# EAGLE design iot1 (EAGLE 9.6.2)

## Sheet 1 of 6
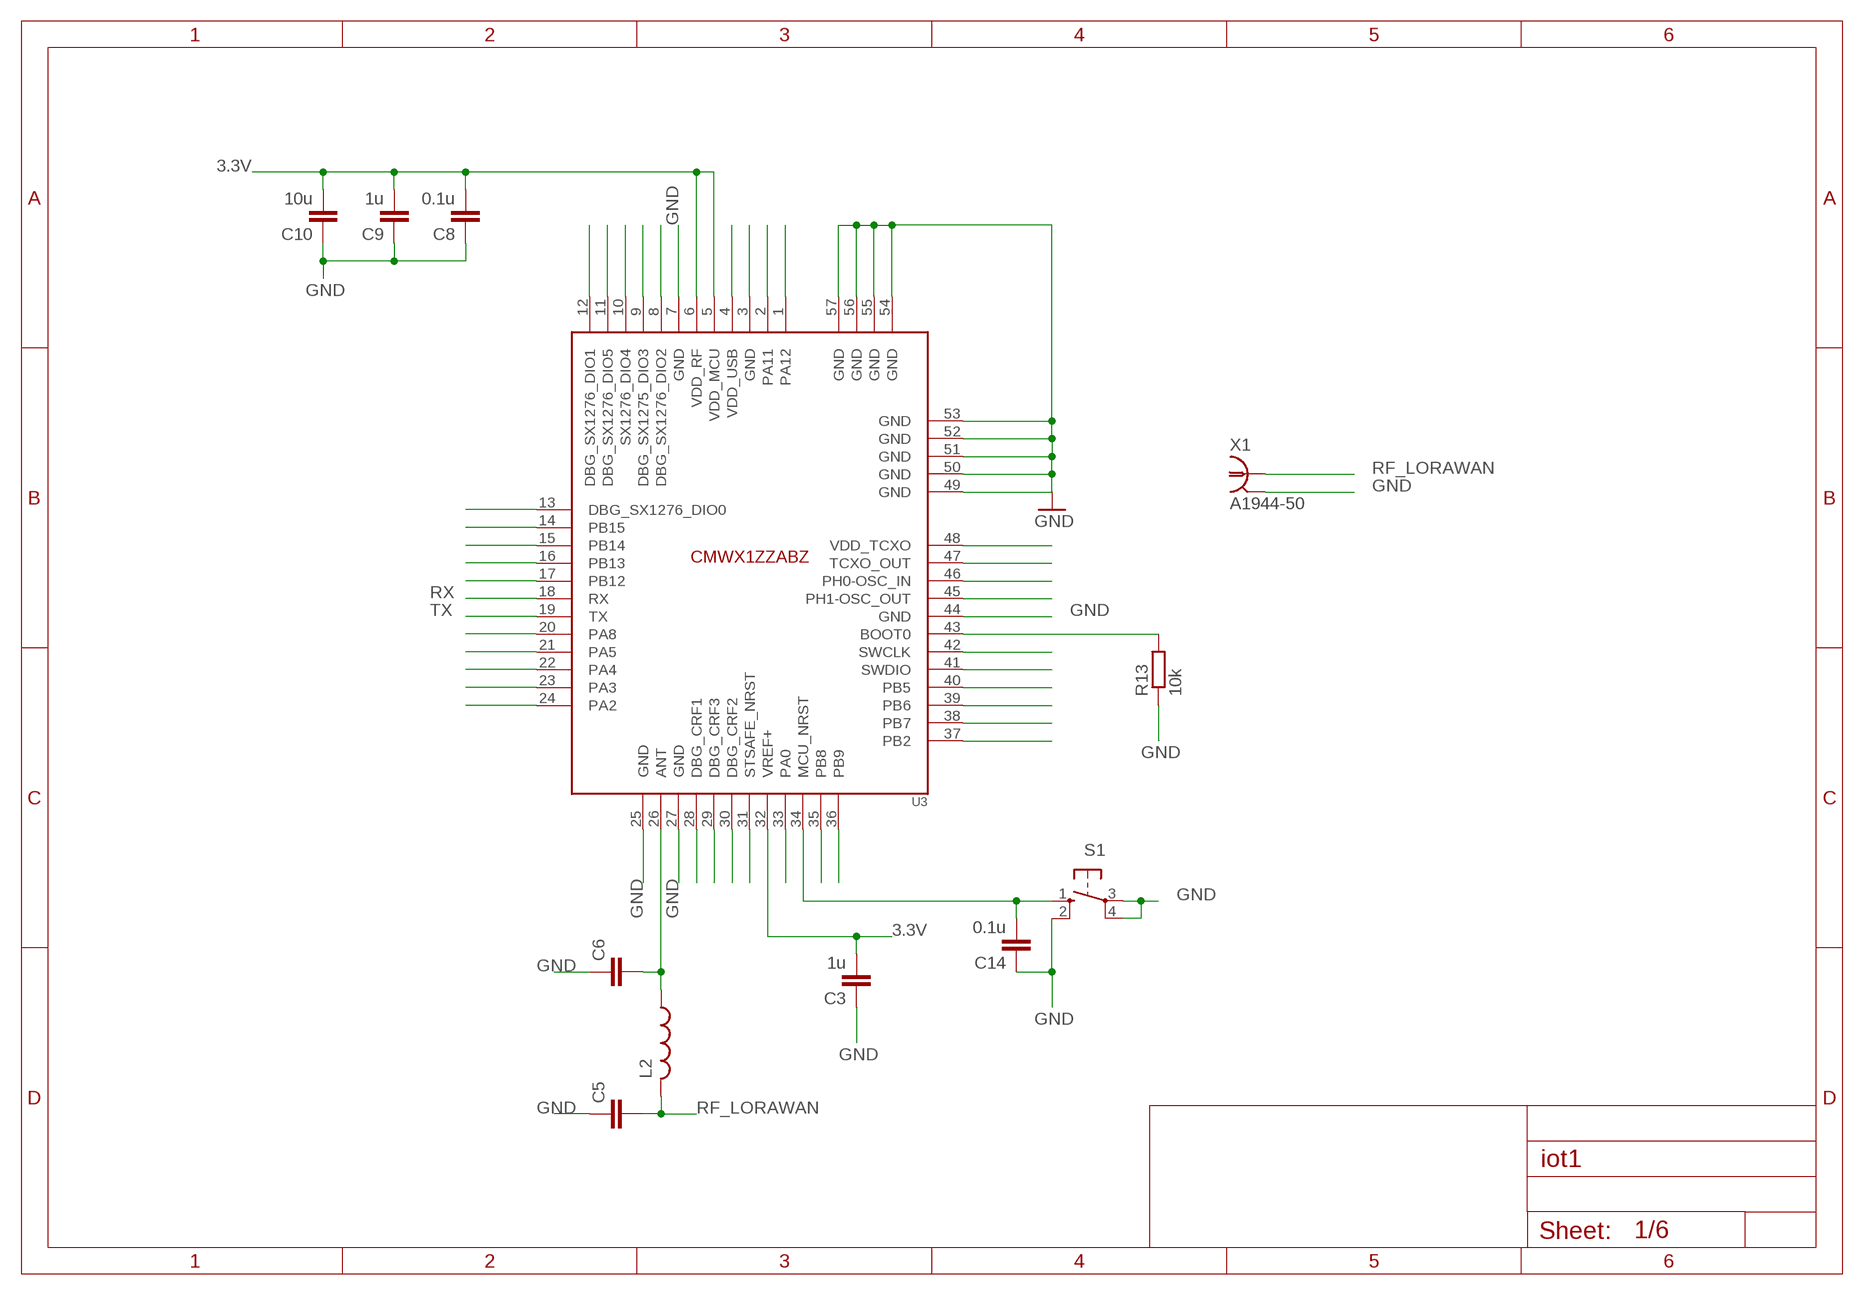
[diagram p0: schematic, sheet 1]

### Parts
C3  1u  C-EU050-025X075  [C050-025X075]
C5  C-EU050-025X075  [C050-025X075]
C6  C-EU050-025X075  [C050-025X075]
C8  0.1u  C-EU050-025X075  [C050-025X075]
C9  1u  C-EU050-025X075  [C050-025X075]
C10  10u  C-EU050-025X075  [C050-025X075]
C14  0.1u  C-EU050-025X075  [C050-025X075]
L2  L-US0207/7  [0207/7]
R13  10k  R-EU_0204/5  [0204/5]
S1  10-XX  [B3F-10XX]
U3  CMWX1ZZABZ  [CMWX1ZZABZ]
X1  A1944-50  [A1944]

### Nets
3.3V: C3.2 C8.2 C9.2 C10.2 U3.5(VDD_MCU) U3.6(VDD_RF) U3.32(VREF+) ; also sheet 2,4,6
GND: C3.1 C5.1 C6.1 C8.1 C9.1 C10.1 C14.1 R13.1 S1.2(S1) S1.3(P) S1.4(P1) U3.7(GND) U3.25(GND) U3.27(GND) U3.44(GND) U3.49(GND) U3.50(GND) U3.51(GND) U3.52(GND) U3.53(GND) U3.54(GND) U3.55(GND) U3.56(GND) U3.57(GND) X1.2 X1.3 X1.4 X1.5 ; also sheet 2,3,4,5,6
N$1: U3.12(DBG_SX1276_DIO1)
N$2: U3.11(DBG_SX1276_DIO5)
N$3: U3.10(SX1276_DIO4)
N$4: U3.9(DBG_SX1275_DIO3)
N$5: U3.8(DBG_SX1276_DIO2)
N$6: U3.4(VDD_USB)
N$10: U3.3(GND)
N$11: U3.2(PA11)
N$12: U3.1(PA12)
N$17: U3.13(DBG_SX1276_DIO0)
N$18: U3.14(PB15)
N$19: U3.15(PB14)
N$20: U3.16(PB13)
N$21: U3.17(PB12)
N$24: U3.20(PA8)
N$25: U3.21(PA5)
N$26: U3.22(PA4)
N$27: U3.23(PA3)
N$28: U3.24(PA2)
N$30: C6.2 L2.1 U3.26(ANT)
N$32: U3.28(DBG_CRF1)
N$33: U3.29(DBG_CRF3)
N$34: U3.30(DBG_CRF2)
N$35: U3.31(STSAFE_NRST)
N$37: U3.33(PA0)
N$38: C14.2 S1.1(S) U3.34(MCU_NRST)
N$39: U3.35(PB8)
N$40: U3.36(PB9)
N$46: U3.48(VDD_TCXO)
N$47: U3.47(TCXO_OUT)
N$48: U3.46(PH0-OSC_IN)
N$49: U3.45(PH1-OSC_OUT)
N$51: R13.2 U3.43(BOOT0)
N$52: U3.42(SWCLK)
N$53: U3.41(SWDIO)
N$54: U3.40(PB5)
N$55: U3.39(PB6)
N$56: U3.38(PB7)
N$57: U3.37(PB2)
RF_LORAWAN: C5.2 L2.2 X1.1
RX: U3.18(RX) ; also sheet 3
TX: U3.19(TX) ; also sheet 3

## Sheet 2 of 6
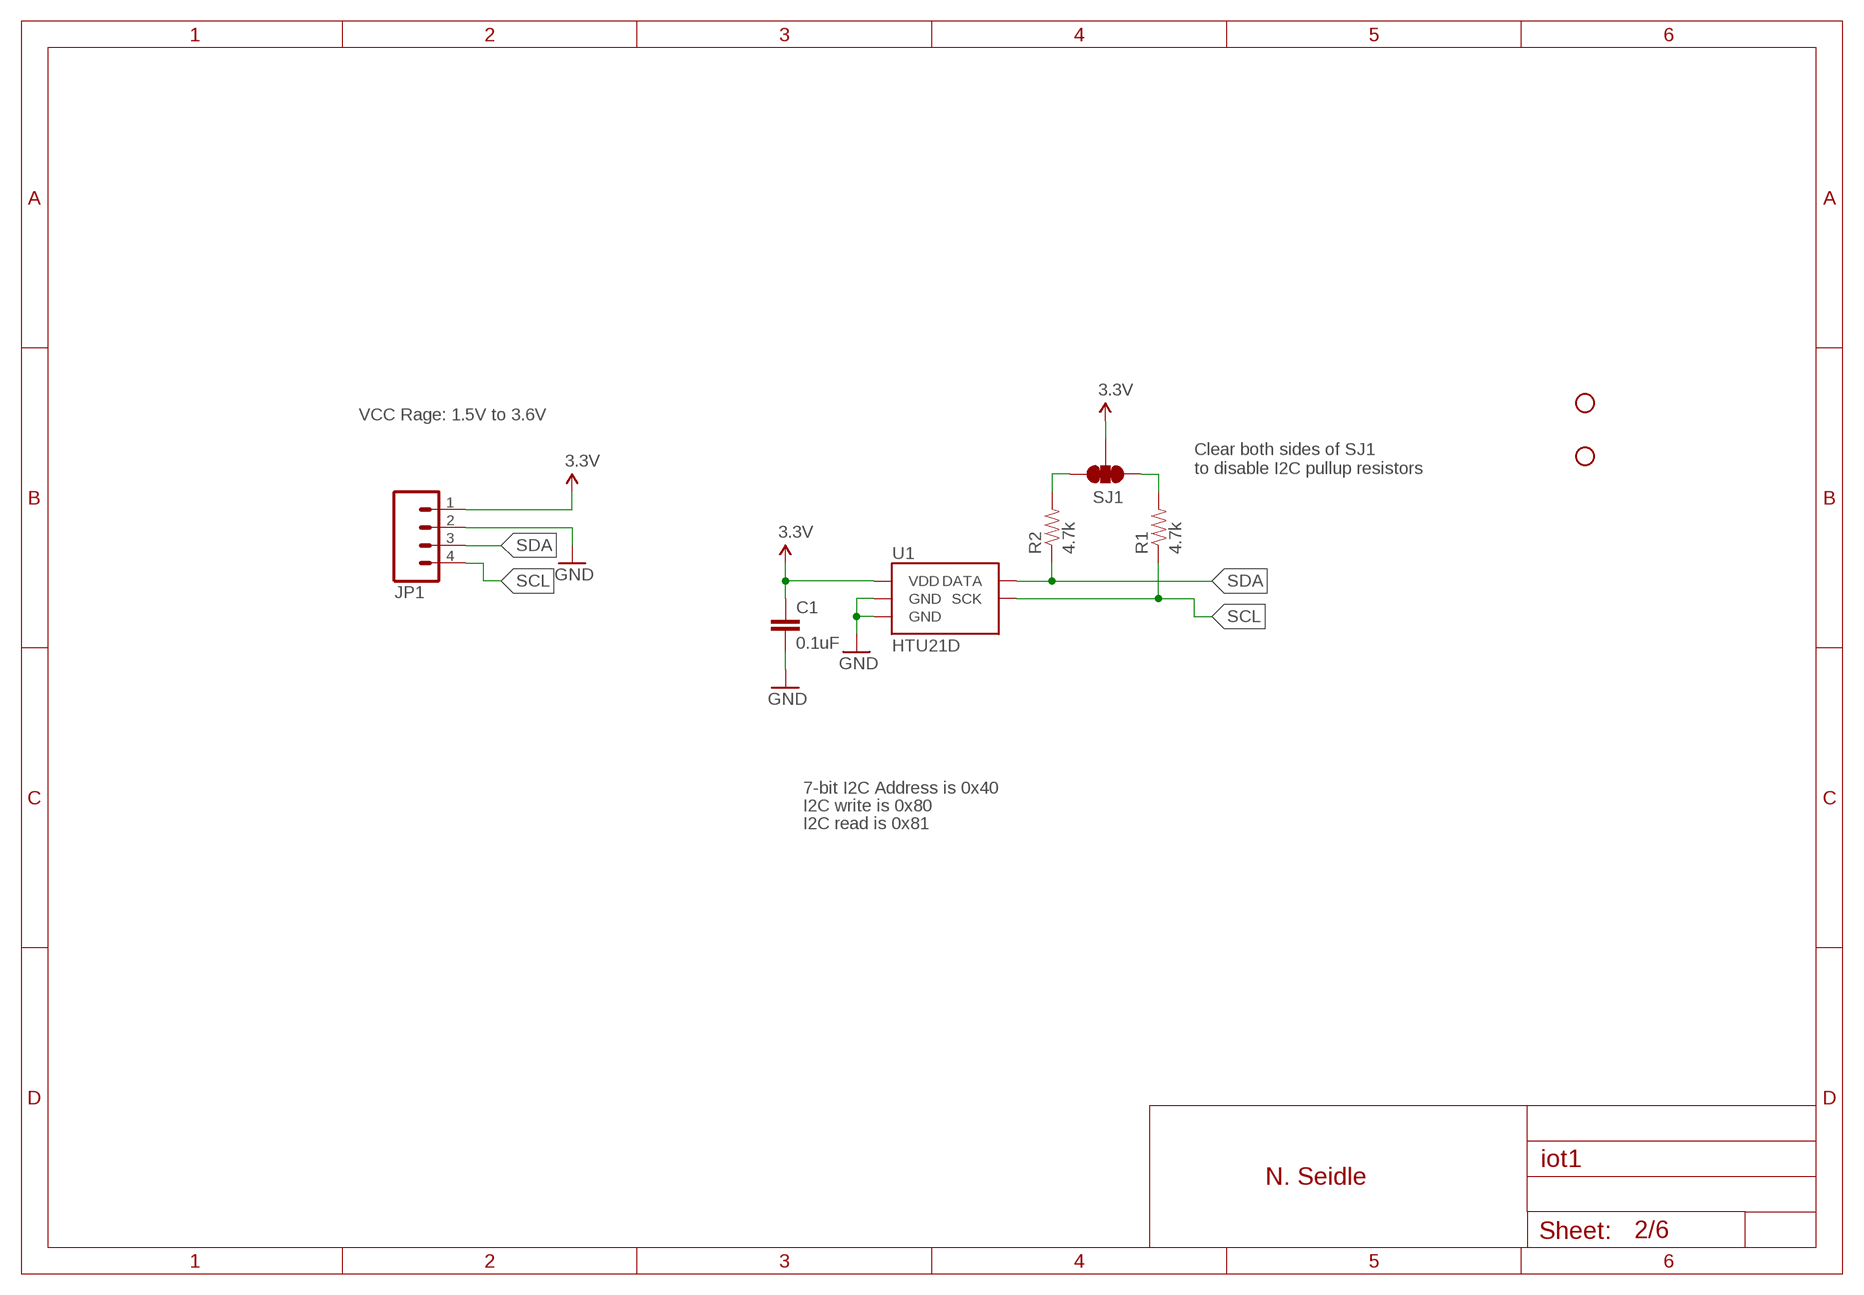
[diagram p1: schematic, sheet 2]

### Parts
C1  0.1uF  CAP0603-CAP  [0603-CAP]
JP1  M04PTH  [1X04]
R1  4.7k  RESISTOR0603-RES  [0603-RES]
R2  4.7k  RESISTOR0603-RES  [0603-RES]
SJ1  SOLDERJUMPER_2WAYPASTE1&2&3  [SJ_3_PASTE1&2&3]
STANDOFF1  STAND-OFF  [STAND-OFF]
STANDOFF3  STAND-OFF  [STAND-OFF]
U1  HTU21D  HTU21DSMD  [HTU21D]

### Nets
3.3V: C1.1 JP1.1 SJ1.2 U1.VDD ; also sheet 1,4,6
GND: C1.2 JP1.2 U1.7(GND) U1.GND ; also sheet 1,3,4,5,6
N$13: R2.2 SJ1.3
N$14: R1.2 SJ1.1
SCL: JP1.4 R1.1 U1.SCK ; also sheet 3,4
SDA: JP1.3 R2.1 U1.DATA ; also sheet 3,4

### Notes on the sheet
- VCC Rage: 1.5V to 3.6V
- Clear both sides of SJ1
  to disable I2C pullup resistors
- 7-bit I2C Address is 0x40
- I2C write is 0x80
- I2C read is 0x81
- N. Seidle

## Sheet 3 of 6
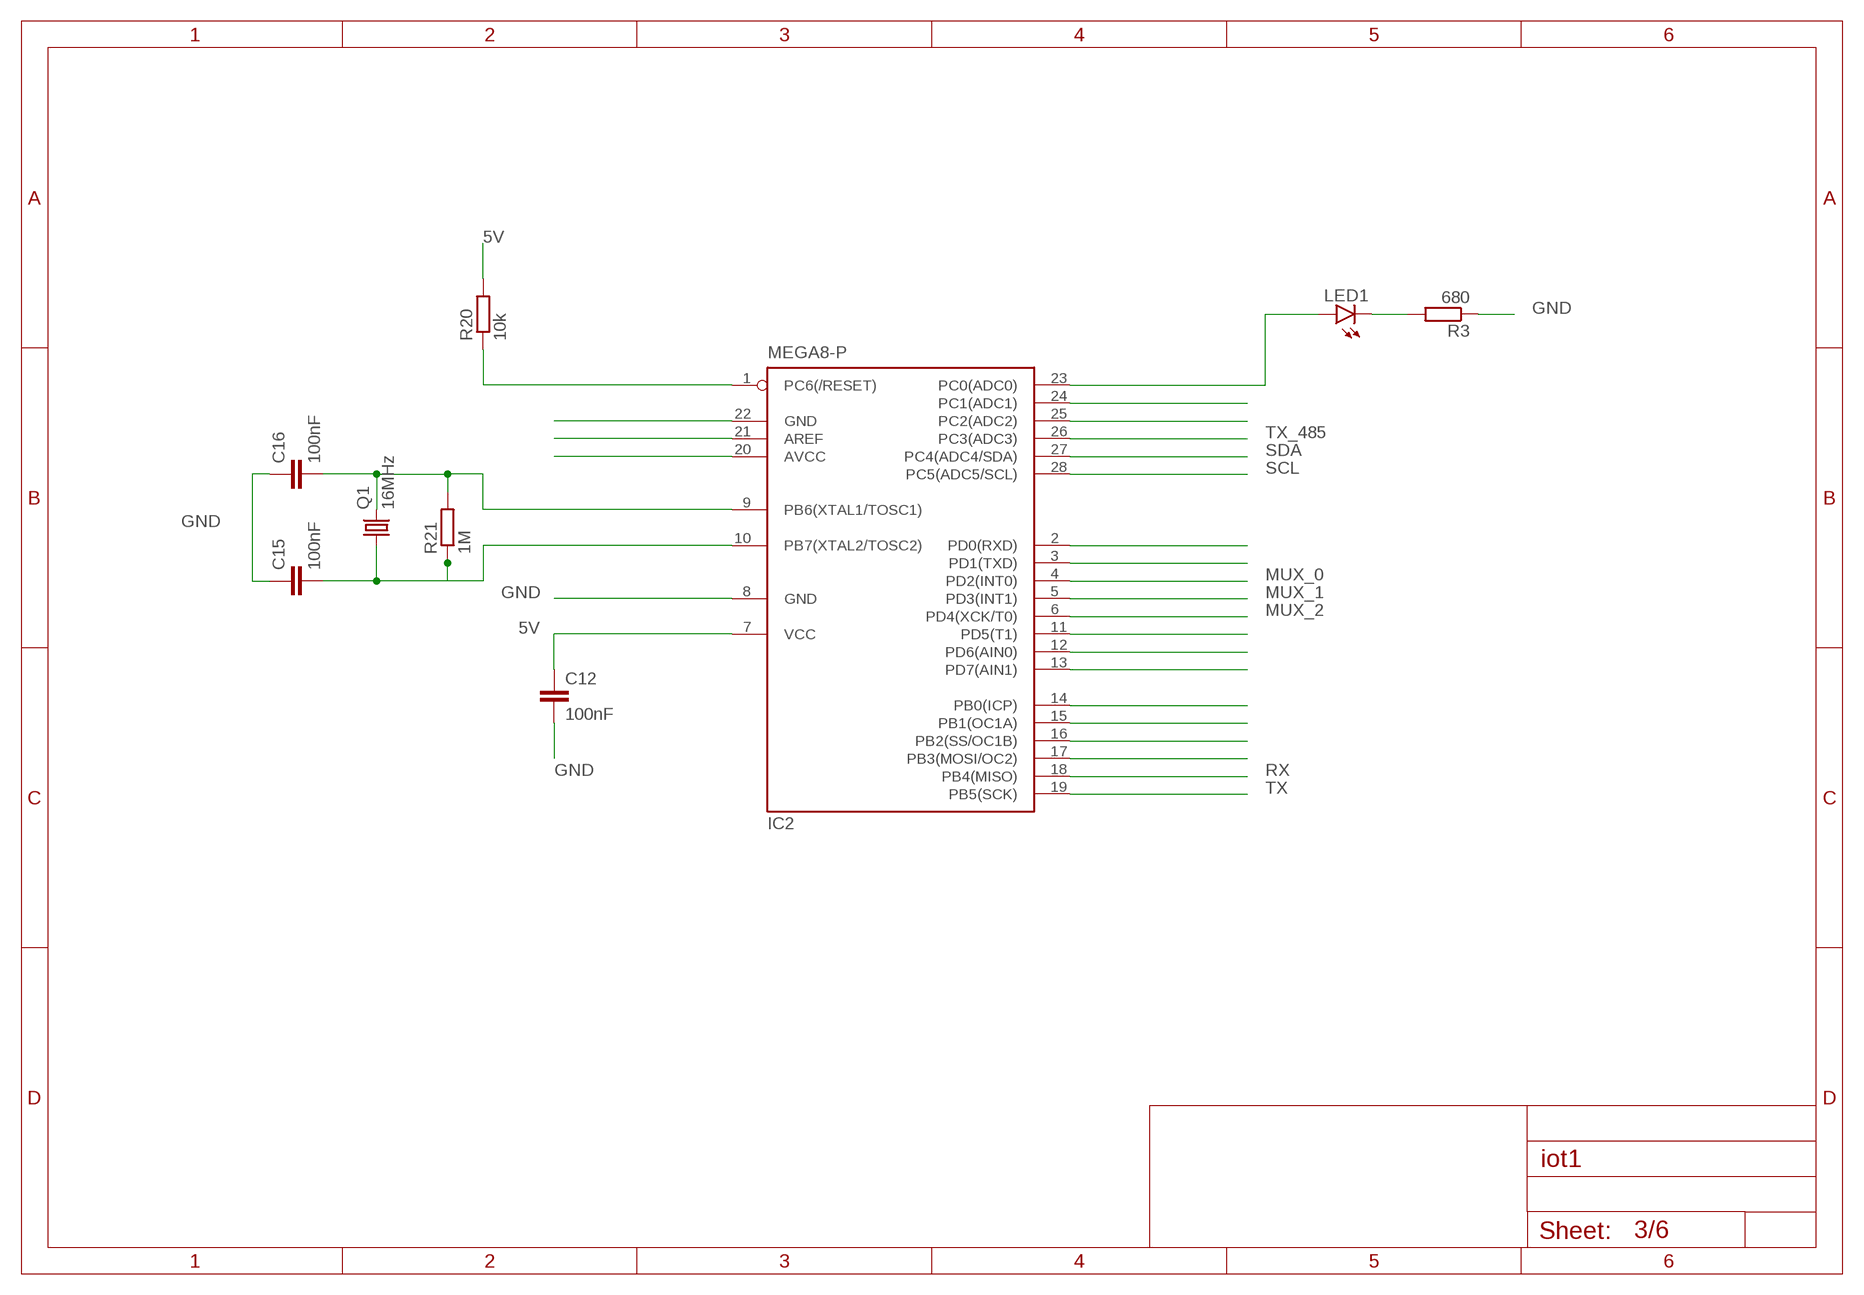
[diagram p2: schematic, sheet 3]

### Parts
C12  100nF  C-EU050-025X075  [C050-025X075]
C15  100nF  C-EU050-025X075  [C050-025X075]
C16  100nF  C-EU050-025X075  [C050-025X075]
IC2  MEGA8-P  [DIL28-3]
LED1  LED3MM  [LED3MM]
Q1  16MHz  CRYSTALHC18U-V  [HC18U-V]
R3  680  R-EU_0207/10  [0207/10]
R20  10k  R-EU_0204/7  [0204/7]
R21  1M  R-EU_0204/7  [0204/7]

### Nets
5V: C12.1 IC2.7(VCC) R20.2 ; also sheet 4,5,6
GND: C12.2 C15.1 C16.1 IC2.8(GND) R3.1 ; also sheet 1,2,4,5,6
MUX_0: IC2.4(PD2(INT0)) ; also sheet 4
MUX_1: IC2.5(PD3(INT1)) ; also sheet 4
MUX_2: IC2.6(PD4(XCK/T0)) ; also sheet 4
N$15: IC2.23(PC0(ADC0)) LED1.A
N$16: IC2.24(PC1(ADC1))
N$22: IC2.25(PC2(ADC2))
N$41: IC2.2(PD0(RXD))
N$42: IC2.3(PD1(TXD))
N$58: IC2.11(PD5(T1))
N$59: IC2.12(PD6(AIN0))
N$60: IC2.13(PD7(AIN1))
N$61: IC2.14(PB0(ICP))
N$62: IC2.15(PB1(OC1A))
N$63: IC2.16(PB2(SS/OC1B))
N$64: IC2.17(PB3(MOSI/OC2))
N$67: IC2.1(PC6(/RESET)) R20.1
N$68: IC2.22(GND)
N$69: IC2.21(AREF)
N$70: IC2.20(AVCC)
N$72: C15.2 IC2.10(PB7(XTAL2/TOSC2)) Q1.1 R21.1
N$73: C16.2 IC2.9(PB6(XTAL1/TOSC1)) Q1.2 R21.2
N$76: LED1.K(C) R3.2
RX: IC2.18(PB4(MISO)) ; also sheet 1
SCL: IC2.28(PC5(ADC5/SCL)) ; also sheet 2,4
SDA: IC2.27(PC4(ADC4/SDA)) ; also sheet 2,4
TX: IC2.19(PB5(SCK)) ; also sheet 1
TX_485: IC2.26(PC3(ADC3)) ; also sheet 6

## Sheet 4 of 6
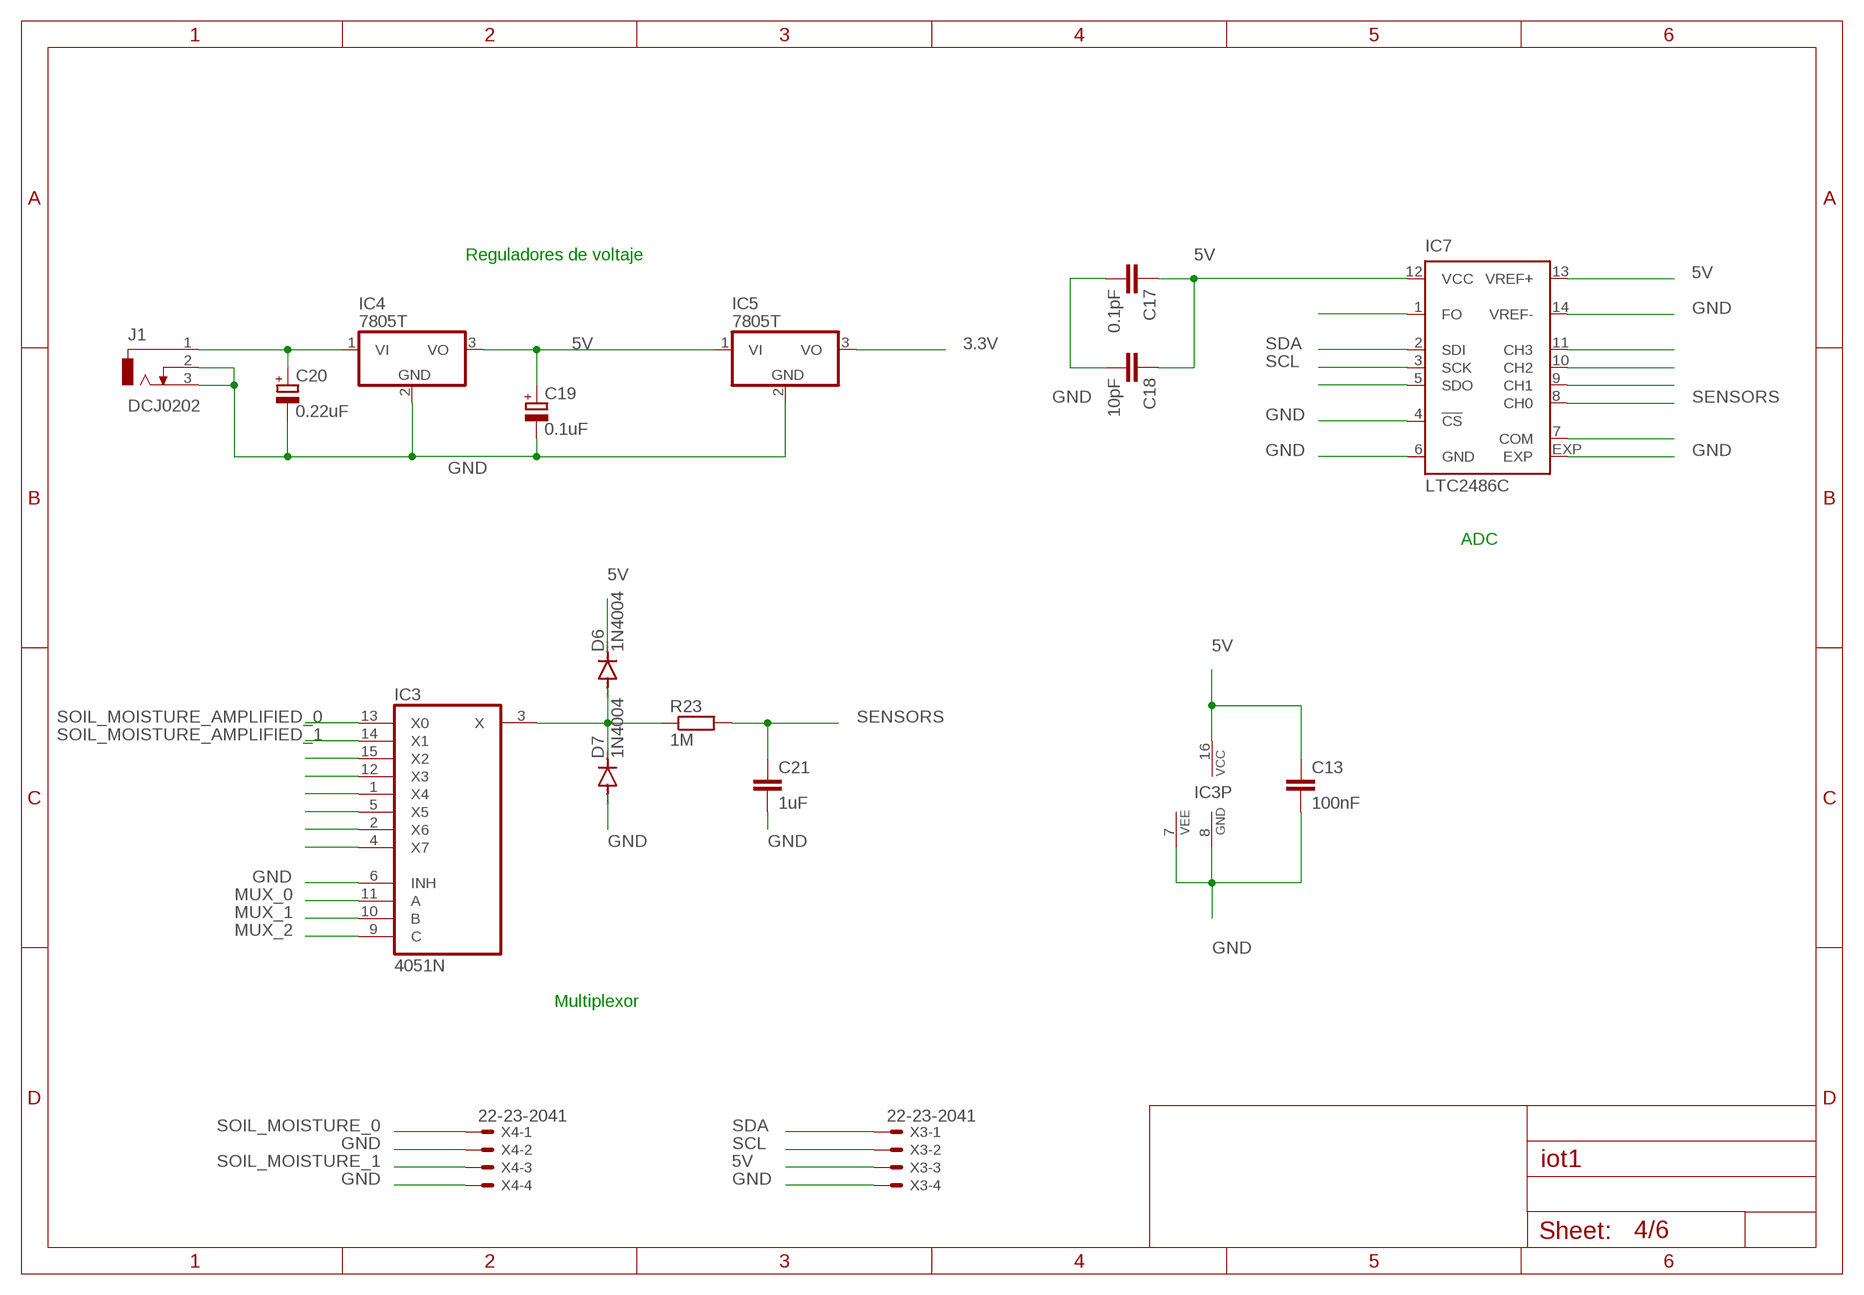
[diagram p3: schematic, sheet 4]

### Parts
C13  100nF  C-EUC0603  [C0603]
C17  0.1pF  C-EUC0603  [C0603]
C18  10pF  C-EUC0603  [C0603]
C19  0.1uF  CPOL-EUE1.8-4  [E1,8-4]
C20  0.22uF  CPOL-EUE1.8-4  [E1,8-4]
C21  1uF  C-EUC0603  [C0603]
D6  1N4004  [DO41-10]
D7  1N4004  [DO41-10]
IC3  4051N  [DIL16]
IC4  7805T  [TO220H]
IC5  7805T  [TO220H]
IC7  LTC2486C  [DFN14-4X3]
J1  DCJ0202  [DCJ0202]
R23  1M  R-EU_0207/10  [0207/10]
X3  22-23-2041  [22-23-2041]
X4  22-23-2041  [22-23-2041]

### Nets
3.3V: IC5.3(VO) ; also sheet 1,2,6
5V: C13.1 C17.1 C18.1 C19.+ D6.C IC3.16(VCC) IC4.3(VO) IC5.1(VI) IC7.12(VCC) IC7.13(VREF+) X3.3 ; also sheet 3,5,6
GND: C13.2 C17.2 C18.2 C19.- C20.- C21.2 D7.A IC3.6(INH) IC3.7(VEE) IC3.8(GND) IC4.2(GND) IC5.2(GND) IC7.4(!CS) IC7.6(GND) IC7.14(VREF-) IC7.EXP J1.2 J1.3 X3.4 X4.2 X4.4 ; also sheet 1,2,3,5,6
MUX_0: IC3.11(A) ; also sheet 3
MUX_1: IC3.10(B) ; also sheet 3
MUX_2: IC3.9(C) ; also sheet 3
N$9: IC3.15(X2)
N$29: IC3.12(X3)
N$31: IC7.5(SDO)
N$36: IC3.1(X4)
N$50: IC3.5(X5)
N$65: IC3.2(X6)
N$66: IC3.4(X7)
N$71: IC7.11(CH3)
N$74: IC7.10(CH2)
N$75: IC7.9(CH1)
N$77: IC7.7(COM)
S: D6.A D7.C IC3.3(X) R23.1
SCL: IC7.1(FO) IC7.3(SCK) X3.2 ; also sheet 2,3
SDA: IC7.2(SDI) X3.1 ; also sheet 2,3
SENSORS: C21.1 IC7.8(CH0) R23.2
SOIL_MOISTURE_0: X4.1 ; also sheet 5
SOIL_MOISTURE_1: X4.3 ; also sheet 5
SOIL_MOISTURE_AMPLIFIED_0: IC3.13(X0) ; also sheet 5
SOIL_MOISTURE_AMPLIFIED_1: IC3.14(X1) ; also sheet 5
V_IN: C20.+ IC4.1(VI) J1.1

### Notes on the sheet
- Reguladores de voltaje
- ADC
- Multiplexor

## Sheet 5 of 6
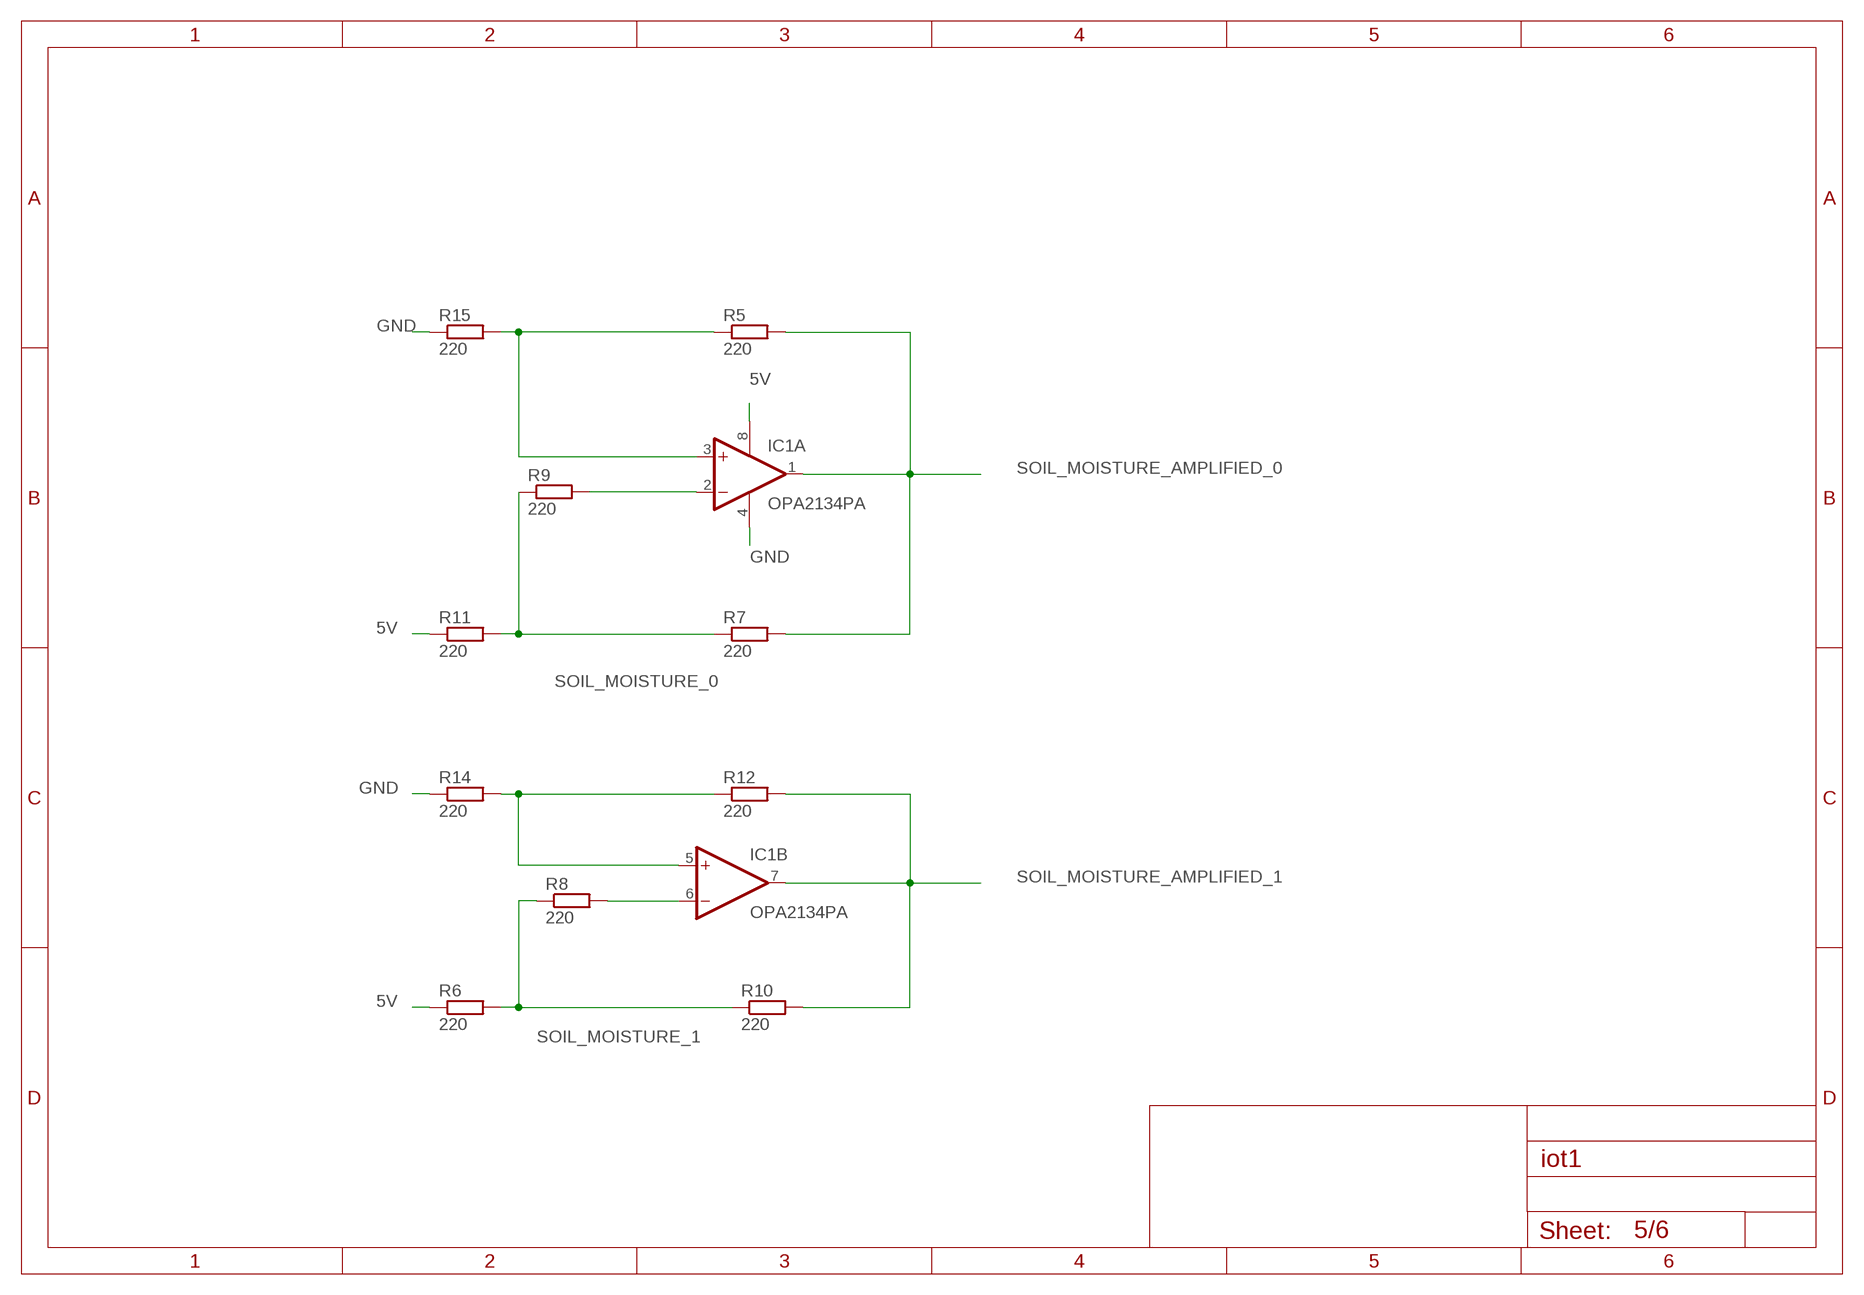
[diagram p4: schematic, sheet 5]

### Parts
IC1  OPA2134PA  [DIL08]
R5  220  R-EU_0207/10  [0207/10]
R6  220  R-EU_0207/10  [0207/10]
R7  220  R-EU_0207/10  [0207/10]
R8  220  R-EU_0207/10  [0207/10]
R9  220  R-EU_0207/10  [0207/10]
R10  220  R-EU_0207/10  [0207/10]
R11  220  R-EU_0207/10  [0207/10]
R12  220  R-EU_0207/10  [0207/10]
R14  220  R-EU_0207/10  [0207/10]
R15  220  R-EU_0207/10  [0207/10]

### Nets
5V: IC1.8(A:V+) R6.1 R11.1 ; also sheet 3,4,6
GND: IC1.4(A:V-) R14.1 R15.1 ; also sheet 1,2,3,4,6
N$78: IC1.3(A:+IN) R5.1 R15.2
N$81: IC1.2(A:-IN) R9.2
N$82: IC1.5(B:+IN) R12.1 R14.2
N$83: IC1.6(B:-IN) R8.2
SOIL_MOISTURE_0: R7.1 R9.1 R11.2 ; also sheet 4
SOIL_MOISTURE_1: R6.2 R8.1 R10.1 ; also sheet 4
SOIL_MOISTURE_AMPLIFIED_0: IC1.1(A:OUT) R5.2 R7.2 ; also sheet 4
SOIL_MOISTURE_AMPLIFIED_1: IC1.7(B:OUT) R10.2 R12.2 ; also sheet 4

## Sheet 6 of 6
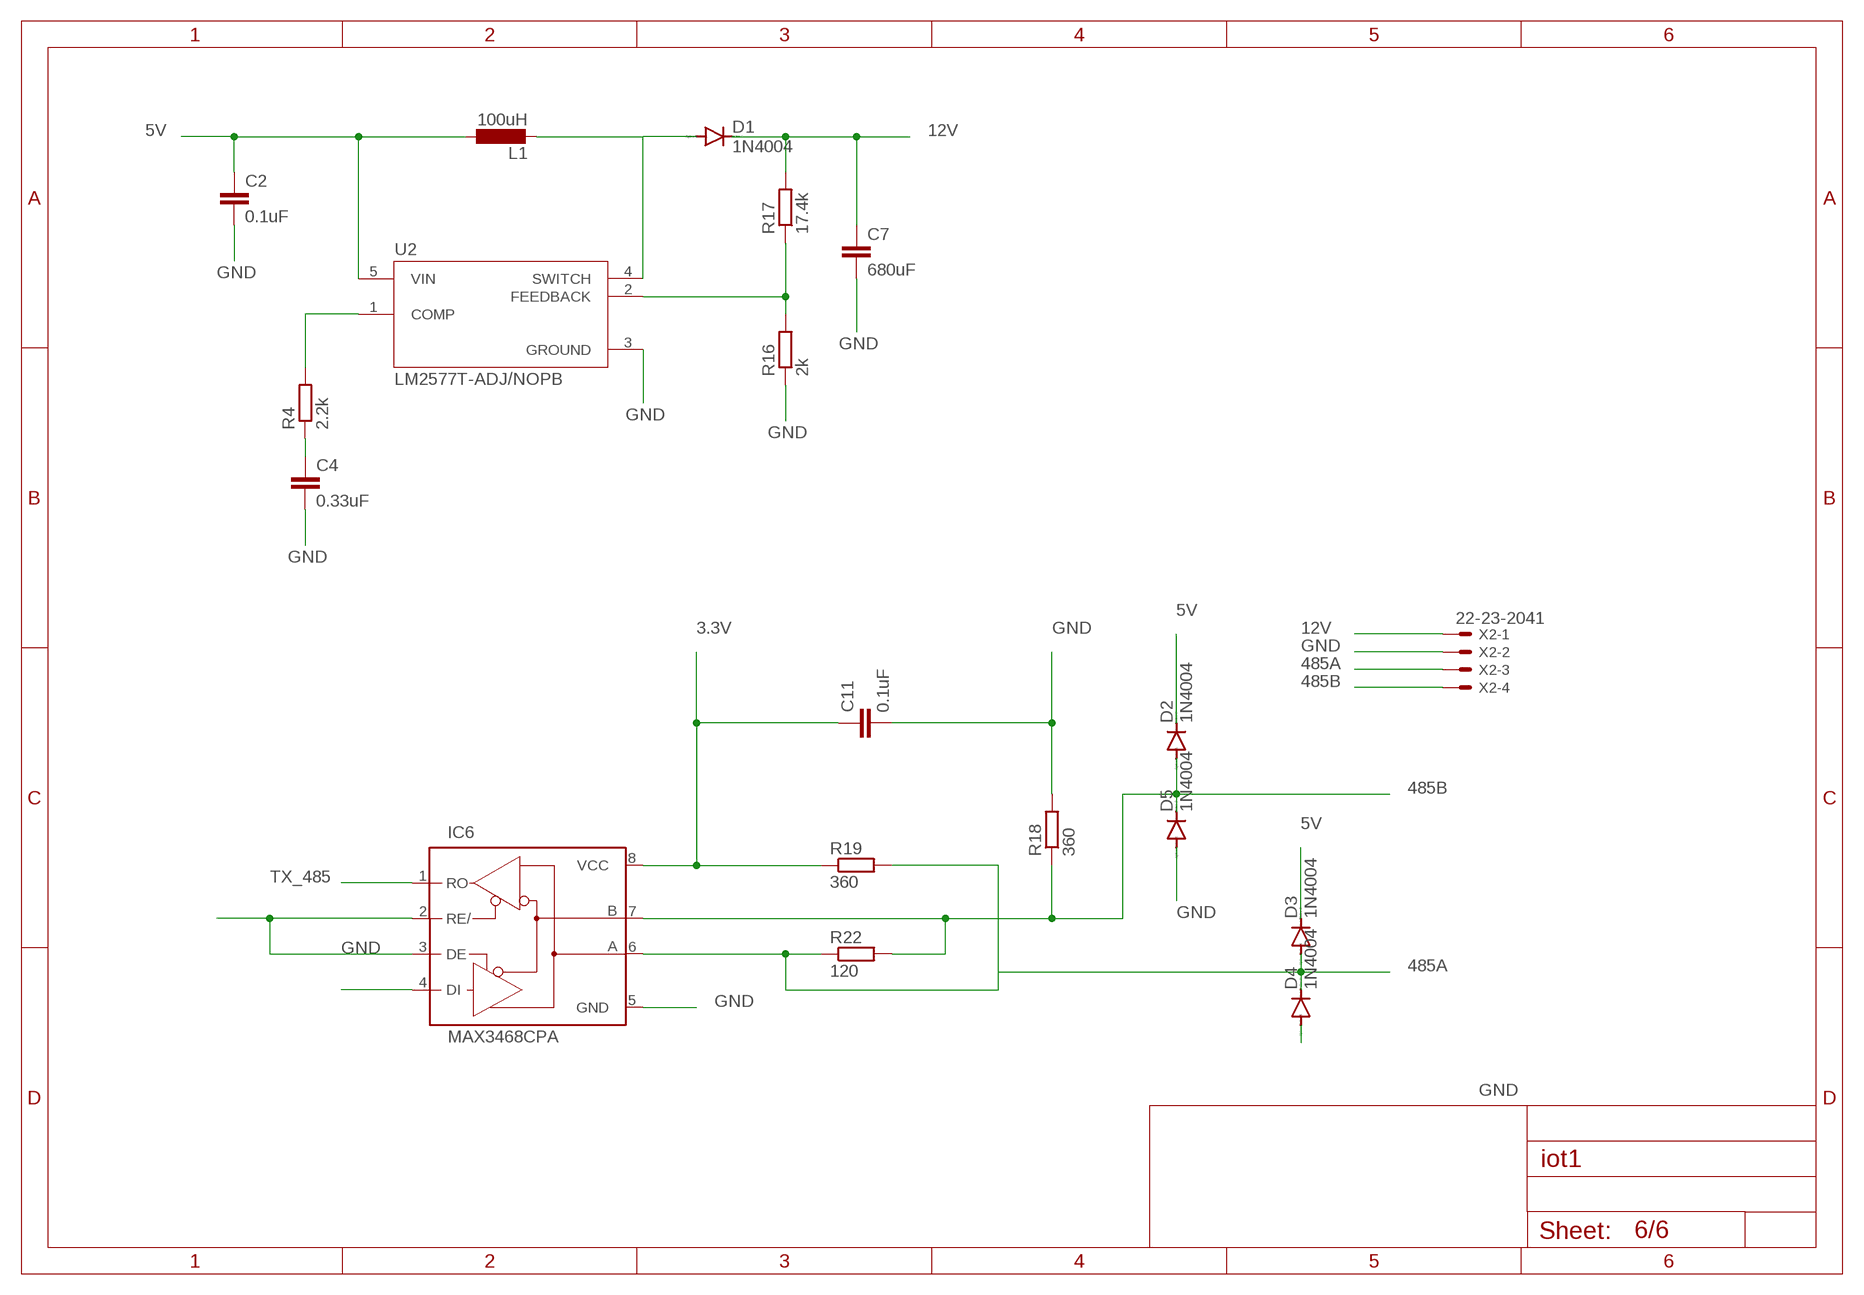
[diagram p5: schematic, sheet 6]

### Parts
C2  0.1uF  C-EU025-024X044  [C025-024X044]
C4  0.33uF  C-EU025-024X044  [C025-024X044]
C7  680uF  C-EU025-024X044  [C025-024X044]
C11  0.1uF  C-EU025-024X044  [C025-024X044]
D1  1N4004  [DO41-10]
D2  1N4004  [DO41-10]
D3  1N4004  [DO41-10]
D4  1N4004  [DO41-10]
D5  1N4004  [DO41-10]
IC6  MAX3468CPA  [DIL08]
L1  100uH  L-EUL1812  [L1812]
R4  2.2k  R-EU_0204/7  [0204/7]
R16  2k  R-EU_0204/7  [0204/7]
R17  17.4k  R-EU_0204/7  [0204/7]
R18  360  R-EU_0207/10  [0207/10]
R19  360  R-EU_0207/10  [0207/10]
R22  120  R-EU_0207/10  [0207/10]
U2  LM2577T-ADJ/NOPB  [VREG_LM2577T-ADJ/NOPB]
X2  22-23-2041  [22-23-2041]

### Nets
3.3V: C11.1 IC6.8(VCC) R19.1 ; also sheet 1,2,4
5V: C2.1 D2.C D3.C L1.1 U2.5(VIN) ; also sheet 3,4,5
12V: C7.1 D1.C R17.2 X2.1
485A: D3.A D4.C IC6.6(A) R19.2 R22.1 X2.3
485B: D2.A D5.C IC6.7(B) R18.1 R22.2 X2.4
GND: C2.2 C4.2 C7.2 C11.2 D4.A D5.A IC6.2(RE/) IC6.3(DE) IC6.5(GND) R16.1 R18.2 U2.3(GROUND) X2.2 ; also sheet 1,2,3,4,5
N$45: D1.A L1.2 U2.4(SWITCH)
N$84: R4.2 U2.1(COMP)
N$85: C4.1 R4.1
N$87: R16.2 R17.1 U2.2(FEEDBACK)
N$88: IC6.4(DI)
TX_485: IC6.1(RO) ; also sheet 3

## Library data of the parts
C1 = SparkFun:CAP: Capacitor Standard 0603 ceramic capacitor, and 0.1" leaded capacitor.
C2-C18 C21 = rcl:C-EU: CAPACITOR, European symbol; SPICEPREFIX: C
C19 C20 = rcl:CPOL-EU: POLARIZED CAPACITOR, European symbol; SPICEPREFIX: C
D1-D7 = diode:1N4004: DIODE general purpose rectifier, 1 A
IC1 = linear:OPA2*: Dual Operational Amplifier Low Power, Single-Supply, Rail-To-Rail Operational Amplifier Source: http://focus.ti.com/lit/ds/symlink/opa2345.pdf http://focus.ti.com .. opa241.pdf http://focus.ti.com/lit/ds/symlink/opa2134.pdf
IC2 = atmel:MEGA8-P: MICROCONTROLLER 8 Kbytes FLASH, 1 kbytes SRAM, 512 bytes EEPROM, USART, 4-channel 10 bit ADC, 2-channel 8 bit ADC Pin compatible with Atmega48, ATMega88, ATMega168 Source: avr.lbr; OC_FARNELL: unknown; OC_NEWARK: unknown
IC3 = 40xx:4051: 8-channel ANALOG MULTIPLEXER
IC4 IC5 = linear:78*: Positive VOLTAGE REGULATOR Source: http://cache.national.com/ds/LM/LM78L05.pdf http://www.fairchildsemi.com/ds/LM/LM7805.pdf
IC6 = maxim:MAX34*: +5V, Fail-Safe, 40Mbps, Profibus RS-485/RS-422 Transceivers Source: MAX3465-MAX3469.pdf; OC_FARNELL: unknown; OC_NEWARK: unknown
IC7 = linear-technology:LTC2486: 16-Bit 2-/4-Channel Delta Sigma ADC with PGA and Easy Drive Input Current Cancellation Source: http://www.linear.com/pc/downloadDocument.do?navId=H0,C1,C1155,C1001,C1152,P36532,D19318; OC_FARNELL: unknown; OC_NEWARK: unknown
J1 = con-jack:DCJ0202: DC POWER JACK Source: DCJ0202.pdf; OC_FARNELL: unknown; OC_NEWARK: unknown
JP1 = SparkFun-Connectors:M04: Header 4 Standard 4-pin 0.1" header. Use with straight break away headers (SKU : PRT-00116), right angle break away headers (PRT-00553), swiss pins (PRT-00743), machine pins (PRT-00117), and female headers (PRT-00115). Molex polarized connector foot print use with SKU : PRT-08231 with associated crimp pins and housings. 1MM SMD Version SKU: PRT-10208
L1 = rcl:L-EU: INDUCTOR, European symbol; SPICEPREFIX: L
L2 = rcl:L-US: INDUCTOR, American symbol; SPICEPREFIX: L
LED1 = led:LED: LED OSRAM: - CHIPLED LG R971, LG N971, LY N971, LG Q971, LY Q971, LO R971, LY R971 LH N974, LH R974 LS Q976, LO Q976, LY Q976 LO Q996 - Hyper CHIPLED LW Q18S LB Q993, LB Q99A, LB R99A - SideLED LS A670, LO A670, LY A670, LG A670, LP A670 LB A673, LV A673, LT A673, LW A673 LH A674 LY A675 LS A676, LA A676, LO A676, LY A676, LW A676 LS A679, LY A679, LG A679 - Hyper Micro SIDELED® LS Y876, LA Y876, LO Y876, LY Y876 LT Y87S - SmartLED LW L88C, LW L88S LB L89C, LB L89S, LG L890 LS L89K, LO L89K, LY L89K LS L896, LA L896, LO L896, LY L896 - TOPLED LS T670, LO T670, LY T670, LG T670, LP T670 LSG T670, LSP T670, LSY T670, LOP T670, LYG T670 LG T671, LOG T671, LSG T671 LB T673, LV T673, LT T673, LW T673 LH T674 LS T676, LA T676, LO T676, LY T676, LB T676, LH T676, LSB T676, LW T676 LB T67C, LV T67C, LT T67C, LS T67K, LO T67K, LY T67K, LW E67C LS E67B, LA E67B, LO E67B, LY E67B, LB E67C, LV E67C, LT E67C LW T67C LS T679, LY T679, LG T679 LS T770, LO T770, LY T770, LG T770, LP T770 LB T773, LV T773, LT T773, LW T773 LH T774 LS E675, LA E675, LY E675, LS T675 LS T776, LA T776, LO T776, LY T776, LB T776 LHGB T686 LT T68C, LB T68C - Hyper Mini TOPLED® LB M676 - Mini TOPLED Santana® LG M470 LS M47K, LO M47K, LY M47K Source: http://www.osram.convergy.de LUXEON: - LUMILED® LXK2-PW12-R00, LXK2-PW12-S00, LXK2-PW14-U00, LXK2-PW14-V00 LXK2-PM12-R00, LXK2-PM12-S00, LXK2-PM14-U00 LXK2-PE12-Q00, LXK2-PE12-R00, LXK2-PE12-S00, LXK2-PE14-T00, LXK2-PE14-U00 LXK2-PB12-K00, LXK2-PB12-L00, LXK2-PB12-M00, LXK2-PB14-N00, LXK2-PB14-P00, LXK2-PB14-Q00 LXK2-PR12-L00, LXK2-PR12-M00, LXK2-PR14-Q00, LXK2-PR14-R00 LXK2-PD12-Q00, LXK2-PD12-R00, LXK2-PD12-S00 LXK2-PH12-R00, LXK2-PH12-S00 LXK2-PL12-P00, LXK2-PL12-Q00, LXK2-PL12-R00 Source: www.luxeon.com KINGBRIGHT: KA-3528ASYC Source: www.kingbright.com
Q1 = crystal:CRYSTAL: CRYSTAL; OC_FARNELL: unknown; OC_NEWARK: unknown
R1 R2 = SparkFun:RESISTOR: Resistor Basic schematic elements and footprints for 0603, 1206, and PTH resistors.
R3-R23 = rcl:R-EU_: RESISTOR, European symbol; SPICEPREFIX: R
S1 = switch-omron:10-XX: OMRON SWITCH; MPN: B3F-1000; OC_FARNELL: 176432; OC_NEWARK: 36M3542
SJ1 = mike-temp:SOLDERJUMPER_2WAY: Solder Jumper 2 way solder jumper
STANDOFF1 STANDOFF3 = SparkFun-Electromechanical:STAND-OFF: #4 Stand Off This is the mechanical footprint for a #4 phillips button head screw. Use the keepout ring to avoid running the screw head into surrounding components. SKU : PRT-00447
U1 = SparkFun-Sensors:HTU21D
U2 = LM2577T-ADJ_NOPB:LM2577T-ADJ/NOPB: SIMPLE SWITCHE ? 3.5V to 40V, 3A Low Component Count Step-Up egulator 5-TO-220 -40 to 125 Check availability <https://pricing.snapeda.com/parts/LM2577T-ADJ/Texas%20Instruments/view-part?ref=eda>; AVAILABILITY: In Stock; DESCRIPTION: SIMPLE SWITCHER&reg; 3.5V to 40V, 3A Low Component Count Step-Up Regulator 5-TO-220 -40 to 125; MF: Texas Instruments; MP: LM2577T-ADJ; PACKAGE: TO-220-5 Texas Instruments; PRICE: None; PURCHASE-URL: https://pricing.snapeda.com/search?q=LM2577T-ADJ&ref=eda
U3 = FaBo-LoRa:CMWX1ZZABZ
X1 = con-coax:A1944-50: BNC CONNECTOR 50 Ohm distributor Buerklin 78F2475; OC_FARNELL: unknown; OC_NEWARK: unknown
X2-X4 = con-molex:22-23-2041: .100" (2.54mm) Center Header - 4 Pin; MF: MOLEX; MPN: 22-23-2041; OC_FARNELL: 1462920; OC_NEWARK: 38C0355

## Board
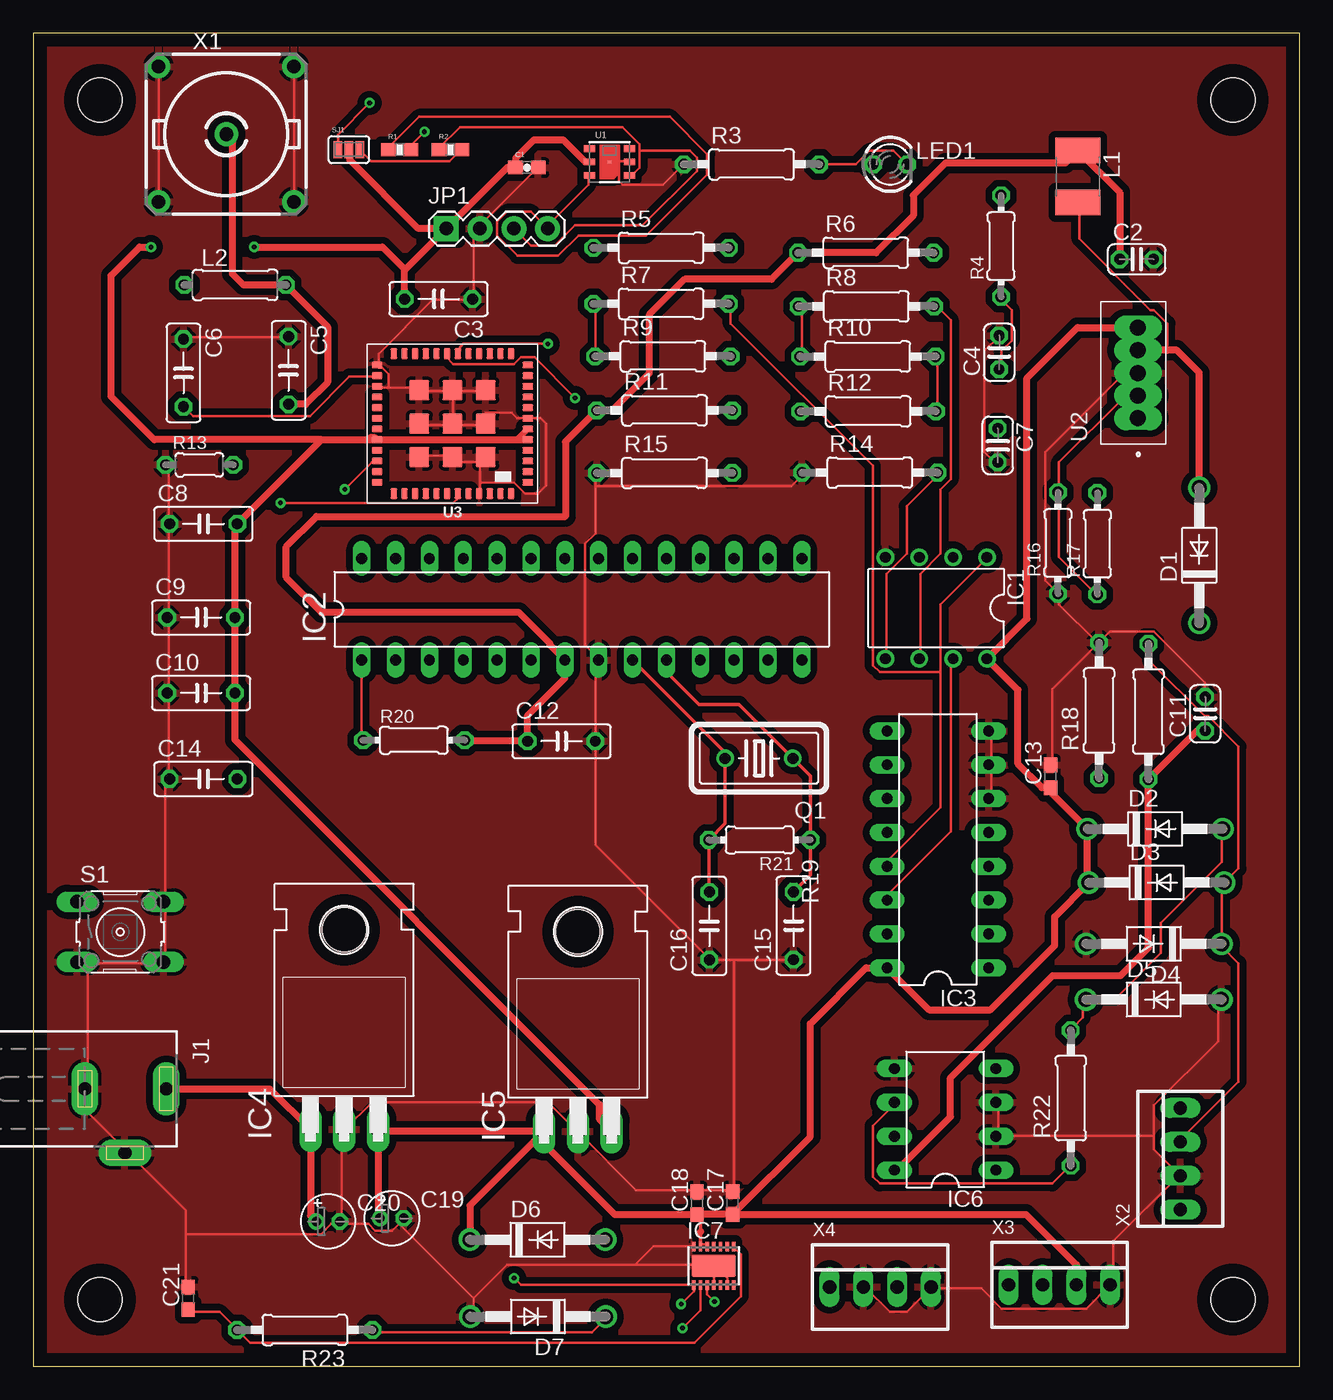
[diagram p6: board, top side]
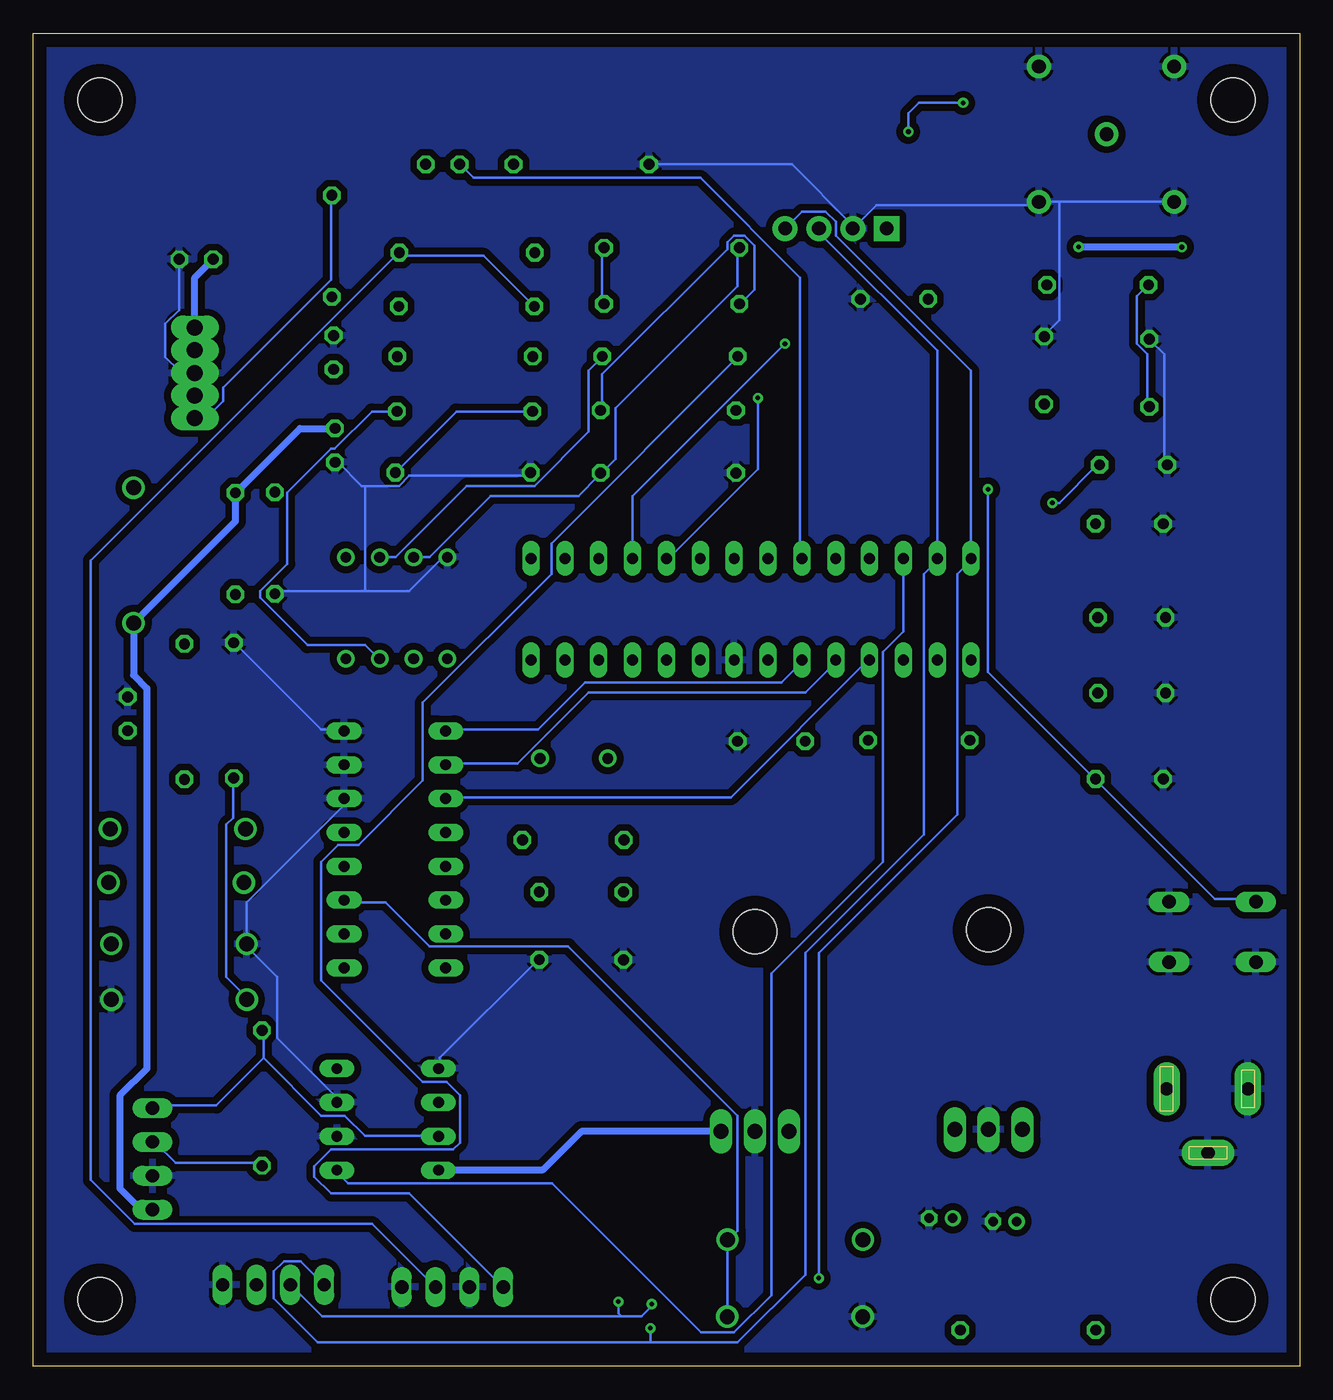
[diagram p7: board, bottom side, seen from below]

Size 95 x 100 mm. Coordinates in mm from the lower left corner, seen from the top.
Outline: 0,0 95,0 95,100 0,100 0,0
Copper layers (1*16): Top 0.035mm / dielectric 1.5mm / Bottom 0.035mm
Design rules "default *": minimum track width 7mil, minimum drill 0.35mm, track to track 20mil, track to pad 6mil, pad to pad 6mil, via to via 20mil, smd to smd 6mil, copper to edge 40mil, drill to drill 6mil, minimum pad ring 10mil, minimum via ring 8mil, stop-mask expansion 4mil, vias tented up to drill 0mil, thermal gap 10mil

### Footprints (pad centres in the part's own frame; a part is rotated, then mirrored left to right if it is on the bottom)
0603-CAP = smd 1.1 x 1: 1 -0.85,0; 2 0.85,0
C025-024X044 = drill 0.813 octagon: 1 -1.27,0; 2 1.27,0
C050-025X075 = drill 0.813 octagon: 1 -2.54,0; 2 2.54,0
C0603 = smd 1.1 x 1: 1 -0.85,0; 2 0.85,0
E1,8-4 = drill 0.711 pad 1.168: + -0.889,0 | drill 0.711 pad 1.168 octagon: - 0.889,0
DO41-10 = drill 1.118: A 5.08,0; C -5.08,0
DIL08 = drill 0.813 pad 1.27: 1 -3.81,-3.81; 2 -1.27,-3.81; 3 1.27,-3.81; 4 3.81,-3.81; 5 3.81,3.81; 6 1.27,3.81; 7 -1.27,3.81; 8 -3.81,3.81
DIL28-3 = drill 0.813 long: 1 -16.51,-3.81; 2 -13.97,-3.81; 3 -11.43,-3.81; 4 -8.89,-3.81; 5 -6.35,-3.81; 6 -3.81,-3.81; 7 -1.27,-3.81; 8 1.27,-3.81; 9 3.81,-3.81; 10 6.35,-3.81; 11 8.89,-3.81; 12 11.43,-3.81; 13 13.97,-3.81; 14 16.51,-3.81; 15 16.51,3.81; 16 13.97,3.81; 17 11.43,3.81; 18 8.89,3.81; 19 6.35,3.81; 20 3.81,3.81; 21 1.27,3.81; 22 -1.27,3.81; 23 -3.81,3.81; 24 -6.35,3.81; 25 -8.89,3.81; 26 -11.43,3.81; 27 -13.97,3.81; 28 -16.51,3.81
DIL16 = drill 0.813 long: 1 -8.89,-3.81; 2 -6.35,-3.81; 3 -3.81,-3.81; 4 -1.27,-3.81; 5 1.27,-3.81; 6 3.81,-3.81; 7 6.35,-3.81; 8 8.89,-3.81; 9 8.89,3.81; 10 6.35,3.81; 11 3.81,3.81; 12 1.27,3.81; 13 -1.27,3.81; 14 -3.81,3.81; 15 -6.35,3.81; 16 -8.89,3.81
TO220H = drill 1.118 long: 1 -2.54,-10.16; 2 0,-10.16; 3 2.54,-10.16 | hole 3.302: 0,4.826
DIL08' = drill 0.813 long: 1 -3.81,-3.81; 2 -1.27,-3.81; 3 1.27,-3.81; 4 3.81,-3.81; 5 3.81,3.81; 6 1.27,3.81; 7 -1.27,3.81; 8 -3.81,3.81
DFN14-4X3 = smd 0.25 x 0.7: 1 -1.5,-1.45; 2 -1,-1.45; 3 -0.5,-1.45; 4 0,-1.45; 5 0.5,-1.45; 6 1,-1.45; 7 1.5,-1.45; 8 1.5,1.45; 9 1,1.45; 10 0.5,1.45; 11 0,1.45; 12 -0.5,1.45; 13 -1,1.45; 14 -1.5,1.45 | smd 3.3 x 1.7: EXP 0,0
DCJ0202 = drill 1 pad 2 long: 1 0,3.1; 2 4.8,0; 3 0,-3
1X04 = drill 1.016 pad 1.88 square: 1 0,0 | drill 1.016 pad 1.88: 2 2.54,0; 3 5.08,0; 4 7.62,0
L1812 = smd 1.9 x 3.4: 1 -1.95,0; 2 1.95,0
0207/7 = drill 0.813 octagon: 1 -3.81,0; 2 3.81,0
LED3MM = drill 0.813 octagon: A -1.27,0; K 1.27,0
HC18U-V = drill 0.813: 1 -2.54,0; 2 2.54,0
0603-RES = smd 1.1 x 1: 1 -0.85,0; 2 0.85,0
0207/10 = drill 0.813 octagon: 1 -5.08,0; 2 5.08,0
0204/7 = drill 0.813 octagon: 1 -3.81,0; 2 3.81,0
0204/5 = drill 0.813 octagon: 1 -2.54,0; 2 2.54,0
B3F-10XX = drill 1.016 long: 1 -3.251,2.261; 2 3.251,2.261; 3 -3.251,-2.261; 4 3.251,-2.261
SJ_3_PASTE1&2&3 = smd 0.635 x 1.27: 1 -0.813,0; 2 0,0; 3 0.813,0
STAND-OFF = hole 3.302: 0,0
HTU21D = smd 0.2 x 0.2: 7 0,0 | smd 0.8 x 0.5: DATA 1.5,-1; GND 1.5,0; NC@1 -1.5,1; NC@6 1.5,1; SCK -1.5,-1; VDD -1.5,0
VREG_LM2577T-ADJ/NOPB = drill 1.2 pad 1.4 long: 1 0,0; 2 1.7,0; 3 3.4,0; 4 5.1,0; 5 6.8,0
CMWX1ZZABZ = smd 0.8 x 0.5: 1 -5.65,4.4; 2 -5.65,3.6; 3 -5.65,2.8; 4 -5.65,2; 5 -5.65,1.2; 6 -5.65,0.4; 7 -5.65,-0.4; 8 -5.65,-1.2; 9 -5.65,-2; 10 -5.65,-2.8; 11 -5.65,-3.6; 12 -5.65,-4.4; 25 5.65,-4.4; 26 5.65,-3.6; 27 5.65,-2.8; 28 5.65,-2; 29 5.65,-1.2; 30 5.65,-0.4; 31 5.65,0.4; 32 5.65,1.2; 33 5.65,2; 34 5.65,2.8; 35 5.65,3.6; 36 5.65,4.4 | smd 0.5 x 0.8: 13 -4.4,-5.25; 14 -3.6,-5.25; 15 -2.8,-5.25; 16 -2,-5.25; 17 -1.2,-5.25; 18 -0.4,-5.25; 19 0.4,-5.25; 20 1.2,-5.25; 21 2,-5.25; 22 2.8,-5.25; 23 3.6,-5.25; 24 4.4,-5.25; 37 4.4,5.25; 38 3.6,5.25; 39 2.8,5.25; 40 2,5.25; 41 1.2,5.25; 42 0.4,5.25; 43 -0.4,5.25; 44 -2,5.25; 45 -1.2,5.25; 46 -2.8,5.25; 47 -3.6,5.25; 48 -4.4,5.25 | smd 1.5 x 1.5: 49 -2.5,2.5; 50 0,2.5; 51 2.5,2.5; 52 -2.5,0; 53 0,0; 54 2.5,0; 55 -2.5,-2.5; 56 0,-2.5; 57 2.5,-2.5
A1944 = drill 1.016 pad 1.778: 1 0,0; 2 5.08,5.08; 3 -5.08,5.08; 4 -5.08,-5.08; 5 5.08,-5.08
22-23-2041 = drill 1 long: 1 -3.81,0; 2 -1.27,0; 3 1.27,0; 4 3.81,0

### Placement (x,y rotation side)
C1  37.03,89.93 0 top
C2  82.78,83.05 0 top
C3  30.4,80.06 180 top
C4  72.47,76.06 90 top
C5  19.15,74.71 270 top
C6  11.26,74.52 270 top
C7  72.36,69.09 270 top
C8  12.76,63.2 0 top
C9  12.59,56.17 0 top
C10  12.59,50.51 0 top
C11  87.92,48.95 90 top
C12  39.62,46.89 0 top
C13  76.31,44.26 90 top
C14  12.76,44.06 0 top
C15  57.04,33.05 90 top
C16  50.72,33.03 90 top
C17  52.46,12.24 90 top
C18  49.8,12.23 90 top
C19  26.9,11.1 0 top
C20  22.11,10.86 0 top
C21  11.62,5.09 90 top
D1  87.48,60.83 90 top
D2  84.16,40.31 0 top
D3  84.28,36.28 0 top
D4  84.07,31.69 180 top
D5  84.06,27.51 0 top
D6  37.83,9.49 0 top
D7  37.86,3.72 180 top
IC1  67.74,56.88 180 top
IC2  41.15,56.79 0 top
IC3  67.87,38.77 90 top
IC4  23.33,27.91 0 top
IC5  40.86,27.77 0 top
IC6  MAX3468CPA  [DIL08']  68.41,18.52 90 top
IC7  51.05,7.53 0 top
J1  6.87,20.8 270 top
JP1  30.98,85.36 0 top
L1  78.37,89.26 270 top
L2  15.14,81.13 0 top
LED1  64.29,90.17 0 top
Q1  54.44,45.61 180 top
R1  27.48,91.27 0 top
R2  31.29,91.27 0 top
R3  53.89,90.17 0 top
R4  72.61,84.04 90 top
R5  47.1,83.91 0 top
R6  62.46,83.54 0 top
R7  47.1,79.71 0 top
R8  62.5,79.51 0 top
R9  47.23,75.77 0 top
R10  62.61,75.76 0 top
R11  47.36,71.72 0 top
R12  62.64,71.64 0 top
R13  12.46,67.63 0 top
R14  62.76,67.04 0 top
R15  47.36,67.02 0 top
R16  76.87,61.76 90 top
R17  79.83,61.71 90 top
R18  79.96,49.2 90 top
R19  83.67,49.11 90 top
R20  28.55,46.96 0 top
R21  54.5,39.48 180 top
R22  77.84,20.12 90 top
R23  20.37,2.72 180 top
S1  6.53,32.58 0 top
SJ1  23.67,91.27 0 top
STANDOFF1  5,95 0 top
STANDOFF2  STAND-OFF  [STAND-OFF]  90,95 0 top
STANDOFF3  5,5 0 top
STANDOFF4  STAND-OFF  [STAND-OFF]  90,5 0 top
U1  43.23,90.35 0 top
U2  82.88,71.12 90 top
U3  31.45,70.71 180 top
X1  14.48,92.43 0 top
X2  86.06,15.56 90 top
X3  76.99,6.11 0 top
X4  63.55,5.94 0 top

### Tracks (layer width: path | path; a pad name or v marks a point on that pad's centre or on a via)
3.3V  (via drill 0.35)
  Top 0.406: U3.6 36.3,69.51 35.22,69.51
  Top 0.508: IC6.8 64.81,14.71 68.81,18.71 68.81,21.64 76.48,29.31 81.58,29.31 83.67,31.39 R19.1 87.31,47.68 C11.1 | C3.2 27.86,82.25 27.9,82.28 | 27.9,82.28 JP1.1 | 21.62,69.51 C8.2 15.13,63.02 C9.2 C10.2 15.13,46.98 42.49,19.62 42.49,18.52 IC5.3 | 21.62,69.51 U3.32 | U3.32 35.22,69.51 U3.5 | SJ1.2 23.76,91.19 23.76,90.47 28.88,85.36 JP1.1 | JP1.1 35.55,89.93 C1.1 36.18,90.64 37.54,92 39.78,92 41.43,90.35 U1.VDD | U3.32 25.65,69.66 25.27,69.66 | 21.62,69.51 9.07,69.51 5.84,72.75 5.84,81.83 7.98,83.96 v8.83,83.96 | v16.57,83.97 26.2,83.97 27.9,82.28
  Bottom 0.508: IC5.3 53.89,17.61 56.79,14.71 IC6.8 | v8.83,83.96 v16.56,83.96 v16.57,83.97
5V
  Top 0.178: 50.06,10.08 50.04,10.16 50.05,10.16 | IC7.13 50.04,9.14 50.55,9.14 IC7.12
  Top 0.254: C18.1 50.05,11.12 50.05,10.16 IC7.13
  Top 0.508: C19.+ 25.87,11.24 IC4.3 26.01,17.61 IC5.1 | IC5.1 32.75,12.05 D6.C | IC5.1 37.9,17.2 37.9,17.1 43.62,11.38 C18.1 | C2.1 81.51,88.07 L1.1 77.44,90.27 68.44,90.27 66.02,87.85 66.02,86.32 63.23,83.54 R6.1 55.38,81.55 48.87,81.55 46.2,78.88 46.2,74.47 43.45,71.72 R11.1 39.92,69.36 39.92,63.75 21.25,63.75 18.97,61.48 18.97,59.18 21.61,56.54 36.45,56.54 38.76,54.23 38.76,54.1 IC2.7 39.88,51.61 37.08,48.82 C12.1 32.44,46.89 R20.2 | IC3.16 64.45,29.88 | C17.1 74.47,11.39 78.26,7.61 X3.3 | 50.05,10.07 50.06,10.08 | 50.06,11.11 C18.1 | C17.1 C18.1 | C17.1 58.29,17.22 58.29,25.69 62.48,29.88 IC3.16 | U2.5 78.34,77.92 74.56,74.14 74.56,56.08 IC1.8 73.88,50.75 73.88,45.2 75.67,43.41 C13.1 76.31,43.08 D2.C 79.08,36.4 D3.C 76.63,33.72 76.63,31.56 71.82,26.75 67.2,26.75 IC3.16
  Bottom 0.508: U2.5 82.88,81.67 C2.1
12V
  Bottom 0.508: X2.1 86.92,11.75 88.5,13.33 88.5,20.3 86.49,22.32 86.49,50.86 87.48,51.85 D1.C 79.83,63.4 R17.2 74.99,70.36 C7.1
485A
  Top 0.178: IC6.6 64.52,19.56 62.99,18.03 62.99,14.22 63.5,13.72 76.45,13.72 77.72,14.99 R22.1 | R19.2 83.82,54.1 83.82,52.83 87.88,48.77 88.14,48.77 90.42,46.48 90.42,37.34 89.41,36.32 D3.A 89.15,36.07 D4.C 89.15,31.5 90.42,30.23 90.42,21.34 86.11,17.02 X2.3
  Bottom 0.178: R22.1 77.98,15.24 84.33,15.24 85.85,16.76 X2.3
485B
  Top 0.178: D2.A 89.15,40.13 89.15,37.85 84.58,33.27 84.58,30.99 81.28,27.69 78.99,27.69 D5.C 78.74,27.43 78.74,26.16 77.98,25.4 R22.2
  Bottom 0.178: R18.1 80.01,43.94 80.01,41.15 80.52,40.64 80.52,29.21 78.99,27.69 D5.C | 77.72,23.11 73.41,18.8 71.63,18.8 70.1,17.27 64.77,17.27 IC6.7 | 77.72,23.11 77.72,25.15 R22.2 | 77.72,23.11 81.28,19.56 85.85,19.56 X2.4
GND
  Top 0.178: 42.16,66.04 42.16,62.48 41.4,61.72 41.4,54.1 42.42,53.09 IC2.8 42.42,52.83 42.16,52.58 C12.2 42.16,39.12 50.55,30.73 C16.1 50.8,30.48 52.58,30.48 | 42.16,66.04 42.16,66.8 R15.1 | C4.2 72.39,77.22 71.37,76.2 71.37,68.58 72.14,67.82 C7.2 | 42.16,66.04 56.9,66.04 57.66,66.8 R14.1 | X4.2 62.48,5.84 64.26,4.06 65.53,4.06 67.31,5.84 X4.4 67.56,5.84 71.12,5.84 72.64,4.32 78.99,4.32 80.77,6.1 X3.4 81.03,6.35 81.03,9.4 85.85,14.22 X2.2 85.85,14.48 84.07,16.26 84.07,17.27 | 72.39,17.27 72.39,19.56 IC6.3 | 84.07,17.27 84.07,19.56 88.9,24.38 88.9,27.43 D5.A | 84.07,17.27 72.39,17.27 | 72.39,17.27 IC6.2 | IC3.6 71.88,42.67 71.88,44.96 IC3.7 71.88,45.21 71.88,47.5 IC3.8 | C13.2 76.45,45.21 76.45,50.8 79.76,54.1 R18.2 | R18.2 79.76,54.36 76.96,57.15 76.96,57.91 R16.1 76.71,58.17 75.95,58.93 75.95,68.58 81.79,74.42 82.8,74.42 U2.3 | C11.2 87.88,50.29 87.88,51.31 84.07,55.12 80.77,55.12 80.01,54.36 R18.2 | 52.58,30.48 56.9,30.48 C15.1 | 52.58,30.48 52.58,13.21 C17.2 52.32,13.21 50.04,13.21 C18.2 49.78,13.21 45.21,13.21 40.89,17.53 IC5.2 40.64,17.78 38.61,19.81 25.4,19.81 23.37,17.78 IC4.2 23.11,17.53 23.11,10.92 C20.- | 27.43,10.67 27.69,10.92 C19.- 27.43,10.67 | 27.43,10.67 26.92,10.16 25.65,10.16 25.15,10.67 23.11,10.67 C20.- | IC7.EXP 51.05,6.86 | 51.05,6.86 IC7.4 | 51.05,6.86 51.82,6.86 52.07,6.6 52.07,6.1 IC7.6 | 51.05,7.37 IC7.EXP | 45.16,7.62 35.56,7.62 33.02,5.08 | 45.16,7.62 51.05,7.62 IC7.EXP | 33.02,5.08 33.02,3.81 D7.A | 33.02,5.08 27.43,10.67 | 33.53,67.82 33.53,66.29 | 33.53,66.29 33.53,65.53 U3.44 | 33.53,67.82 33.78,68.07 U3.49 33.53,67.82 | U3.51 28.96,68.33 31.24,68.33 U3.50 31.5,68.07 31.75,67.82 33.53,67.82
  Top 0.178: 26.67,73.41 28.7,73.41 U3.57 28.96,73.15 31.24,73.15 U3.56 31.5,73.15 | 26.67,73.41 25.91,73.41 U3.27 | 26.67,73.41 26.67,74.42 26.16,74.93 25.91,74.93 U3.25 25.91,75.18 25.91,75.95 29.97,80.01 32.77,80.01 C3.1 33.02,80.26 33.02,85.09 33.27,85.34 JP1.2 33.53,85.6 37.85,89.92 C1.2 | 31.5,73.15 33.78,73.15 U3.55 | U3.54 28.96,70.61 31.24,70.61 U3.53 | U3.52 33.78,70.61 31.5,70.61 U3.53 | 31.5,73.15 31.5,70.87 U3.53 | 33.53,66.29 36.07,66.29 36.88,65.48 37.89,65.48 38.47,66.06 38.47,70.72 38.08,71.11 U3.7 36.31,71.11 35.89,71.53 33.95,71.53 U3.52 | 34.04,70.87 U3.52 | 43.94,90.42 43.18,90.42 U1.7 | 43.94,90.42 44.7,90.42 U1.GND | 43.94,90.42 43.94,88.9 44.2,88.65 47.24,88.65 48.77,90.17 R3.1 | X1.3 X1.4 | X1.2 X1.5 | 11.43,9.91 11.43,11.68 7.11,16 J1.2 6.86,16.26 4.06,19.05 4.06,20.57 J1.3 4.06,20.83 4.06,30.23 | 11.43,9.91 11.43,6.1 C21.2 | 4.06,30.23 9.65,30.23 S1.4 9.91,30.48 9.91,34.8 S1.2 9.91,35.05 9.91,43.69 10.16,43.94 C14.1 10.16,44.2 10.16,50.29 C10.1 10.16,50.55 10.16,56.13 C9.1 10.16,56.39 10.16,62.99 C8.1 10.16,63.25 10.16,67.56 R13.1 | 4.06,30.23 3.3,30.23 S1.3 4.06,30.23 | C6.1 11.43,77.22 19.05,77.22 C5.1 | 11.43,9.91 21.59,9.91 22.35,10.67 22.86,10.67 C20.- | 45.16,7.62 46.52,8.98 IC7.14
  Bottom 0.178: 70.1,66.04 70.36,66.04 72.14,67.82 C7.2 | 70.1,66.04 67.56,66.04 66.8,66.8 57.91,66.8 R14.1 | IC3.6 71.88,42.42 71.88,41.91 78.99,34.8 D4.A 78.99,31.5 76.71,29.21 76.71,24.64 72.39,20.32 72.39,19.81 IC6.3 | C2.2 84.07,82.8 84.07,79.25 85.09,78.23 85.09,75.69 84.07,74.68 83.06,74.68 U2.3 | 70.1,58.17 76.71,58.17 R16.1 | 70.1,58.17 66.8,58.17 64.52,60.45 64.01,60.45 IC1.4 | IC3.8 71.88,47.75 73.41,47.75 79.76,54.1 R18.2 | 70.1,58.17 70.1,66.04 | IC6.5 64.52,22.35 64.52,23.11 57.15,30.48 C15.1 | R3.1 38.1,90.17 33.53,85.6 JP1.2 31.75,87.12 19.56,87.12 X1.5 19.56,87.38 18.03,87.38 | 18.03,87.38 9.4,87.38 X1.4 | C6.1 11.18,76.96 10.16,75.95 10.16,67.82 R13.1 | 18.03,87.38 18.03,78.49 19.05,77.47 C5.1
  pour Top: 95.08,99.99 95.22,99.85 95.22,0.25 0,0.25 0,99.86
  pour Bottom: 0,99.71 94.72,99.71 94.89,99.53 94.89,0.42 94.73,0.25 0.52,0.25 0.43,0.34 0.43,99.38 0.34,99.47 0.52,99.64
MUX_0
  Bottom 0.178: IC3.11 64.01,42.67 42.67,42.67 32.26,53.09 IC2.4
MUX_1
  Bottom 0.178: IC3.10 64.01,45.21 58.67,45.21 53.34,50.55 37.08,50.55 34.8,52.83 IC2.5
MUX_2
  Bottom 0.178: IC3.9 64.01,47.75 57.15,47.75 53.59,51.31 38.86,51.31 37.34,52.83 IC2.6
N$13
  Top 0.178: R2.2 32,91.19 31.24,90.42 25.34,90.42 SJ1.3
N$14  (via drill 0.35)
  Top 0.178: R1.2 28.33,91.6 v29.35,92.62 | SJ1.1 22.86,92.41 v25.23,94.78
  Bottom 0.178: v29.35,92.62 29.35,93.99 28.56,94.78 v25.23,94.78
N$15
  Bottom 0.178: IC2.23 37.49,60.76 37.49,81.69 44.96,89.15 61.98,89.15 62.99,90.17 LED1.A
N$30
  Top 0.178: C6.2 11.98,71.27 19.52,71.27 19.55,71.3 20.76,71.3 23.71,74.24 25.73,74.24 U3.26
  Bottom 0.178: L2.1 12.19,80.26 12.19,76.71 11.43,75.95 11.43,72.14 C6.2
N$38  (via drill 0.35)
  Top 0.178: v23.37,65.79 25.4,67.82 25.65,67.82 U3.34
  Bottom 0.178: v23.37,65.79 23.37,52.07 15.49,44.2 C14.2 15.24,43.94 6.35,35.05 3.3,35.05 S1.1
N$45
  Top 0.178: 85.09,76.22 85.09,78.23 84.07,79.25 83.82,79.25 78.49,84.58 78.49,87.12 L1.2
  Top 0.508: U2.4 85.09,76.22 85.81,76.22 87.48,74.55 D1.A | U2.4
N$51  (via drill 0.35)
  Top 0.178: v18.54,64.77 31.5,64.77 31.75,65.02 31.75,65.28 U3.43
  Bottom 0.178: v18.54,64.77 18.03,64.77 15.24,67.56 R13.2
N$67
  Top 0.178: IC2.1 24.64,46.99 R20.1
N$72
  Top 0.254: IC2.10 47.5,52.08 49.94,49.64 52.95,49.64 Q1.1 58.31,44.28 R21.1 58.31,36.85 C15.2
N$73
  Top 0.254: IC2.9 51.91,46.04 Q1.2 51.91,40.7 R21.2 50.69,35.61 C16.2
N$76
  Top 0.178: R3.2 61.72,90.17 62.74,91.19 64.52,91.19 65.53,90.17 LED1.K
N$78
  Bottom 0.178: IC1.3 66.29,60.71 65.28,60.71 60.71,65.28 54.1,65.28 52.58,66.8 R15.2 52.32,67.06 51.31,68.07 51.31,71.88 42.16,81.03 42.16,83.82 R5.1
N$81
  Bottom 0.178: IC1.2 68.83,60.71 67.82,60.71 62.48,66.04 57.4,66.04 53.34,70.1 53.34,74.68 52.32,75.69 R9.2
N$82
  Top 0.178: IC1.5 64.01,53.09 64.01,59.44 65.53,60.96 65.53,64.52 67.82,66.8 R14.2
  Bottom 0.178: R12.1 57.66,71.63 63.25,71.63 67.82,67.06 R14.2
N$83
  Top 0.178: IC1.6 66.55,53.09 66.55,59.44 68.07,60.96 68.07,65.79 68.83,66.55 68.83,78.49 67.82,79.5 R8.2
N$84
  Bottom 0.178: U2.1 82.04,71.12 80.77,72.39 80.77,73.41 72.64,81.53 72.64,87.63 R4.2
N$85
  Top 0.178: C4.1 72.64,74.93 72.64,76.2 73.41,76.96 73.41,79.25 72.64,80.01 R4.1
N$87
  Top 0.178: R17.1 79.76,57.91 76.96,60.71 76.96,65.53 R16.2 76.96,65.79 76.96,67.82 81.79,72.64 82.8,72.64 U2.2
RF_LORAWAN
  Top 0.508: X1.1 14.92,91.99 14.92,81.97 15.76,81.13 L2.2 22.07,78 22.07,73.81 20.43,72.17 C5.2
RX  (via drill 0.35)
  Top 0.178: v38.61,76.71 32.26,76.71 32,76.45 32,76.2 U3.18
  Bottom 0.178: v38.61,76.71 50.04,65.28 IC2.18
S
  Top 0.178: R23.1 25.65,2.54 41.91,2.54 42.93,3.56 D7.C
  Bottom 0.178: IC3.3 71.63,34.8 68.58,34.8 65.28,31.5 54.86,31.5 42.16,18.8 42.16,10.16 42.67,9.65 D6.A 42.93,9.4 42.93,3.81 D7.C
SCL  (via drill 0.35)
  Top 0.178: IC7.1 49.58,6.05 | U1.SCK 41.66,89.15 41.66,88.65 38.61,85.6 JP1.4 37.34,86.61 35.56,86.61 34.8,85.85 34.8,84.84 36.32,83.31 39.37,83.31 40.89,84.84 45.97,84.84 50.55,89.41 50.55,90.93 47.75,93.73 28.96,93.73 26.67,91.44 R1.1 | v36.07,6.6 36.58,6.1 49.53,6.1 IC7.1 | IC7.1 49.55,5.61 v48.6,4.66 | IC7.3 50.55,5.39 v51.1,4.84
  Bottom 0.178: 50.88,3.73 73.33,3.73 75.69,6.1 X3.2 | 50.88,3.73 49.37,3.73 48.6,4.5 v48.6,4.66 | JP1.4 37.34,86.61 35.56,86.61 34.8,85.85 34.8,84.84 24.64,74.68 IC2.28 24.64,60.45 25.65,59.44 25.65,41.4 36.07,30.99 v36.07,6.6 | v51.1,4.84 51.1,3.96 50.88,3.73
SDA  (via drill 0.35)
  Top 0.178: 45.47,91.19 45.47,91.69 44.2,92.96 32,92.96 30.48,91.44 R2.1 | 45.47,91.19 45.47,89.92 44.96,89.41 U1.DATA | 45.47,91.19 49.28,91.19 49.78,90.68 49.78,89.66 45.72,85.6 40.64,85.6 39.12,84.07 37.34,84.07 JP1.3 | IC7.2 50.05,4.21 v48.7,2.86
  Bottom 0.178: JP1.3 35.81,85.34 35.81,84.84 27.18,76.2 IC2.27 27.18,60.45 28.19,59.44 28.19,39.88 37.08,30.99 37.08,6.86 42.16,1.78 48.7,1.78 | 48.7,1.78 73.66,1.78 76.96,5.08 76.96,7.11 76.2,7.87 74.93,7.87 73.41,6.35 X3.1 | 48.7,1.78 v48.7,2.86
SENSORS
  Top 0.178: IC7.8 52.58,8.89 53.09,8.38 53.09,5.26 49.59,1.76 16.27,1.76 15.49,2.54 R23.2 15.24,2.79 13.97,4.06 11.68,4.06 C21.1
SOIL_MOISTURE_0
  Top 0.178: R9.1 42.16,75.95 42.16,79.5 R7.1
  Bottom 0.178: R11.2 52.32,71.88 52.32,74.42 42.93,83.82 42.93,84.33 42.42,84.84 41.66,84.84 40.89,84.07 40.89,80.77 41.91,79.76 R7.1 | X4.1 59.94,6.1 66.8,12.95 72.64,12.95 73.91,14.22 73.91,14.99 72.64,16.26 63.5,16.26 62.99,16.76 62.99,20.32 64.01,21.34 65.79,21.34 73.41,28.96 73.41,37.85 72.14,39.12 70.61,39.12 65.79,43.94 65.79,49.78 56.13,59.44 56.13,61.72 42.16,75.69 R9.1
SOIL_MOISTURE_1
  Top 0.178: R10.1 57.66,75.95 57.66,79.5 R8.1
  Bottom 0.178: R8.1 61.21,83.31 67.31,83.31 R6.2 67.56,83.57 90.68,60.45 90.68,13.97 87.38,10.67 69.6,10.67 65.02,6.1 X4.3
SOIL_MOISTURE_AMPLIFIED_0
  Top 0.178: 68.07,52.07 68.07,57.15 71.37,60.45 IC1.1 | 68.07,52.07 68.07,41.91 64.26,38.1 64.26,37.59 IC3.13 | 68.07,52.07 63.5,52.07 62.99,52.58 62.99,67.56 52.32,78.23 52.32,79.5 R7.2
  Bottom 0.178: R7.2 52.32,79.76 52.32,83.82 R5.2
SOIL_MOISTURE_AMPLIFIED_1
  Top 0.178: R10.2 67.82,75.69 67.82,71.88 R12.2 | IC3.14 64.26,35.05 64.26,35.56 68.83,40.13 68.83,52.83 IC1.7
  Bottom 0.178: R12.2 67.82,71.63 69.6,71.63 72.39,68.83 72.64,68.83 75.95,65.53 75.95,60.2 77.98,58.17 77.98,57.66 74.42,54.1 70.1,54.1 69.09,53.09 IC1.7
TX  (via drill 0.35)
  Top 0.178: v40.64,72.64 37.59,75.69 36.58,75.69 36.07,75.18 31.5,75.18 30.99,75.69 30.99,75.95 U3.19
  Bottom 0.178: v40.64,72.64 40.64,67.31 47.5,60.45 IC2.19
TX_485
  Bottom 0.178: IC2.26 29.72,55.12 31.24,53.59 31.24,37.85 39.62,29.46 39.62,5.33 42.42,2.54 44.9,2.54 56.07,13.72 71.37,13.72 72.14,14.48 IC6.1
V_IN
  Top 0.508: J1.1 17.74,20.8 IC4.1 20.79,11.29 C20.+